# Altium schematic sheet Avalon3.SchDoc
size A0
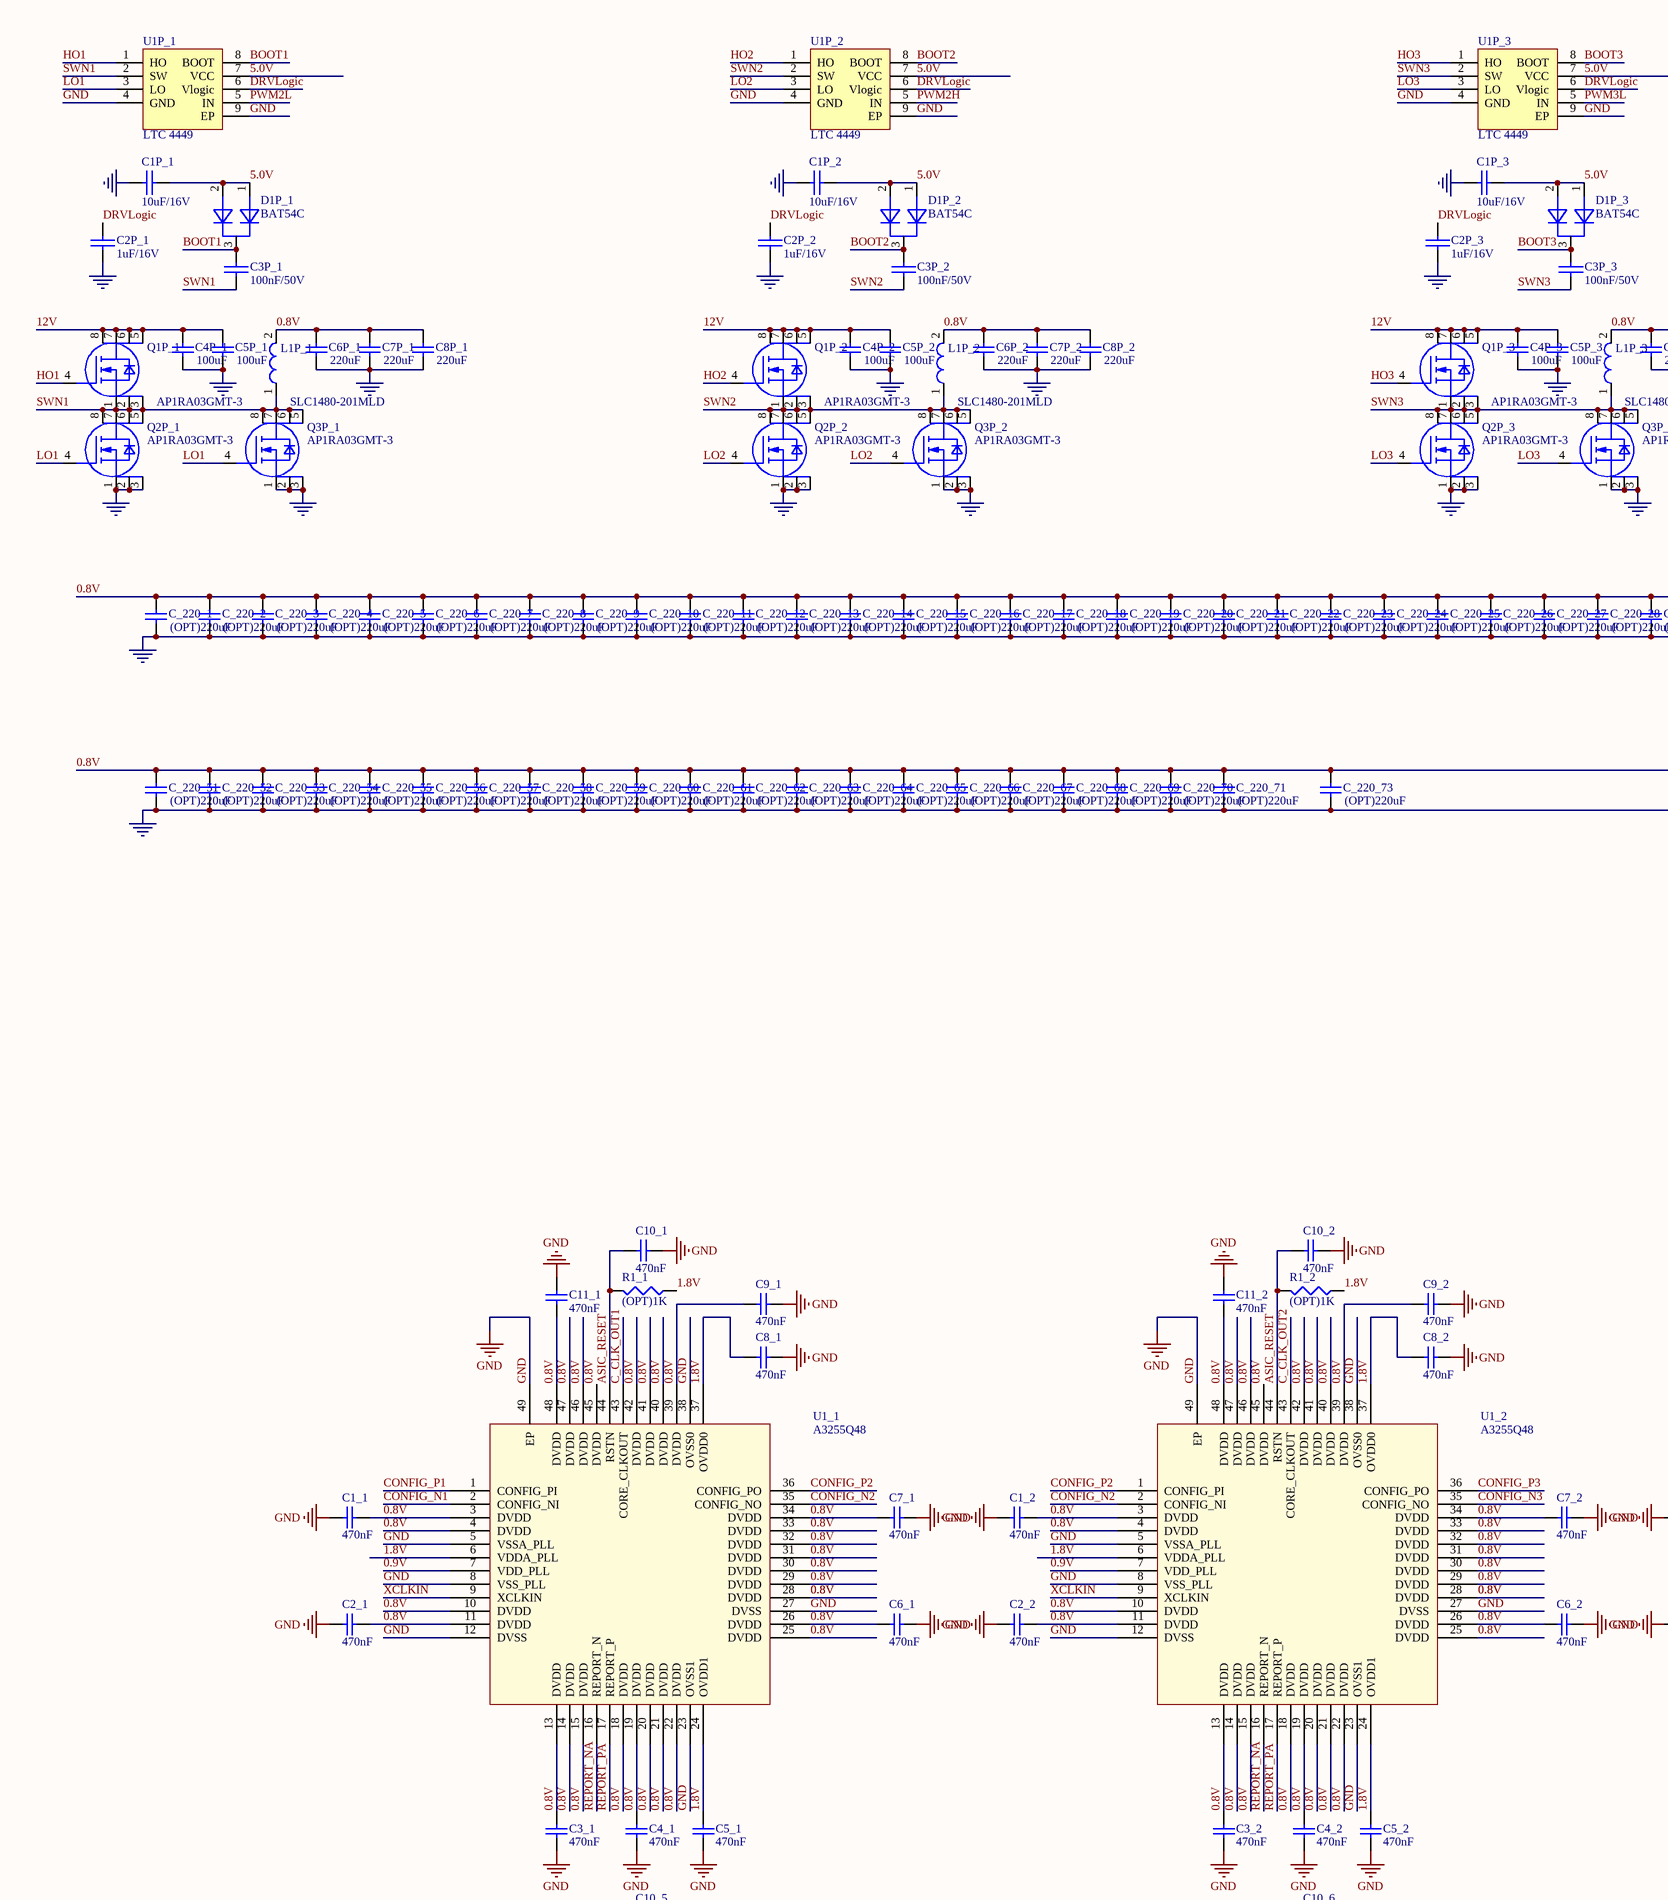
[diagram p0: Avalon3.SchDoc, top left]
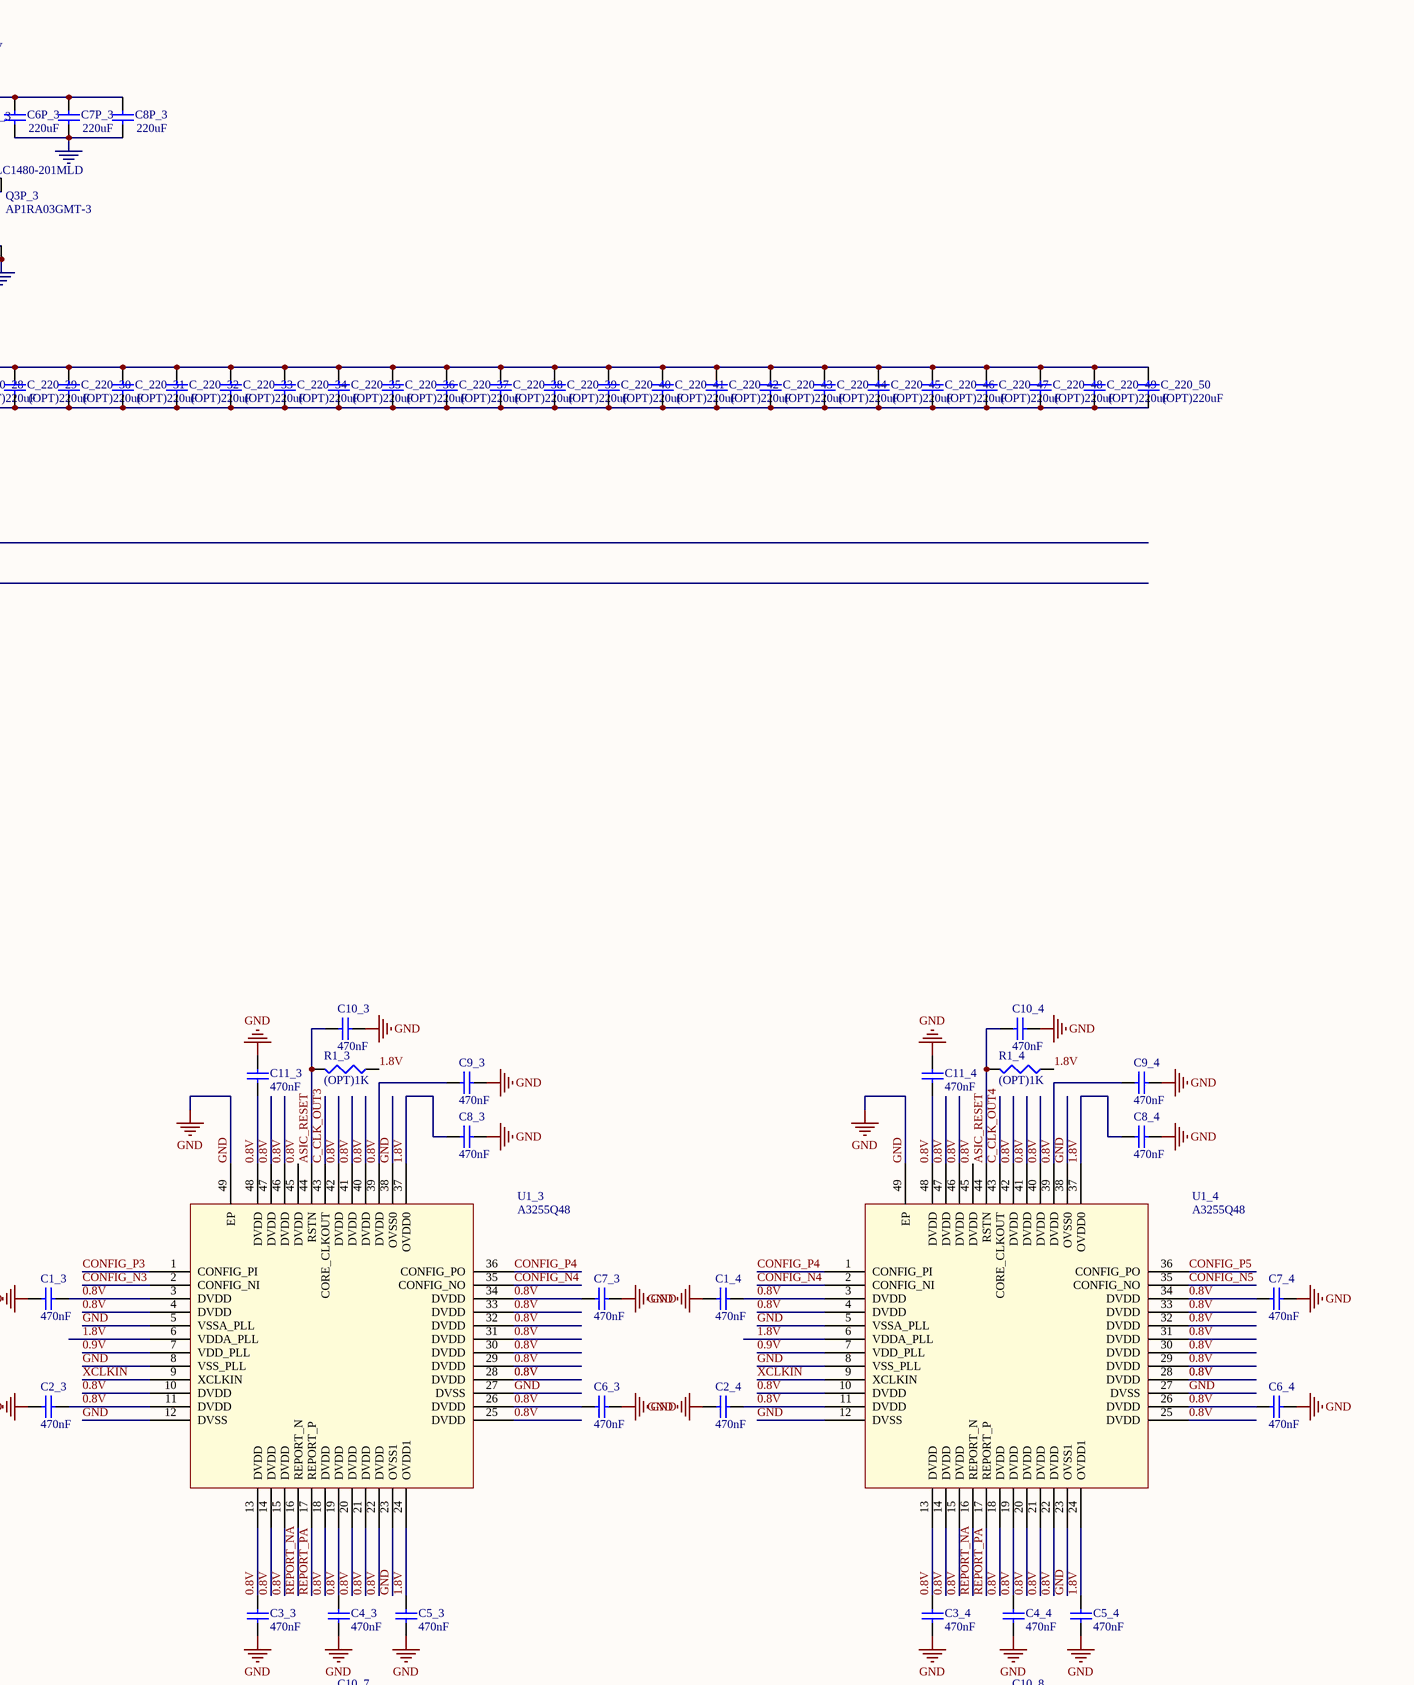
[diagram p1: Avalon3.SchDoc, top middle]
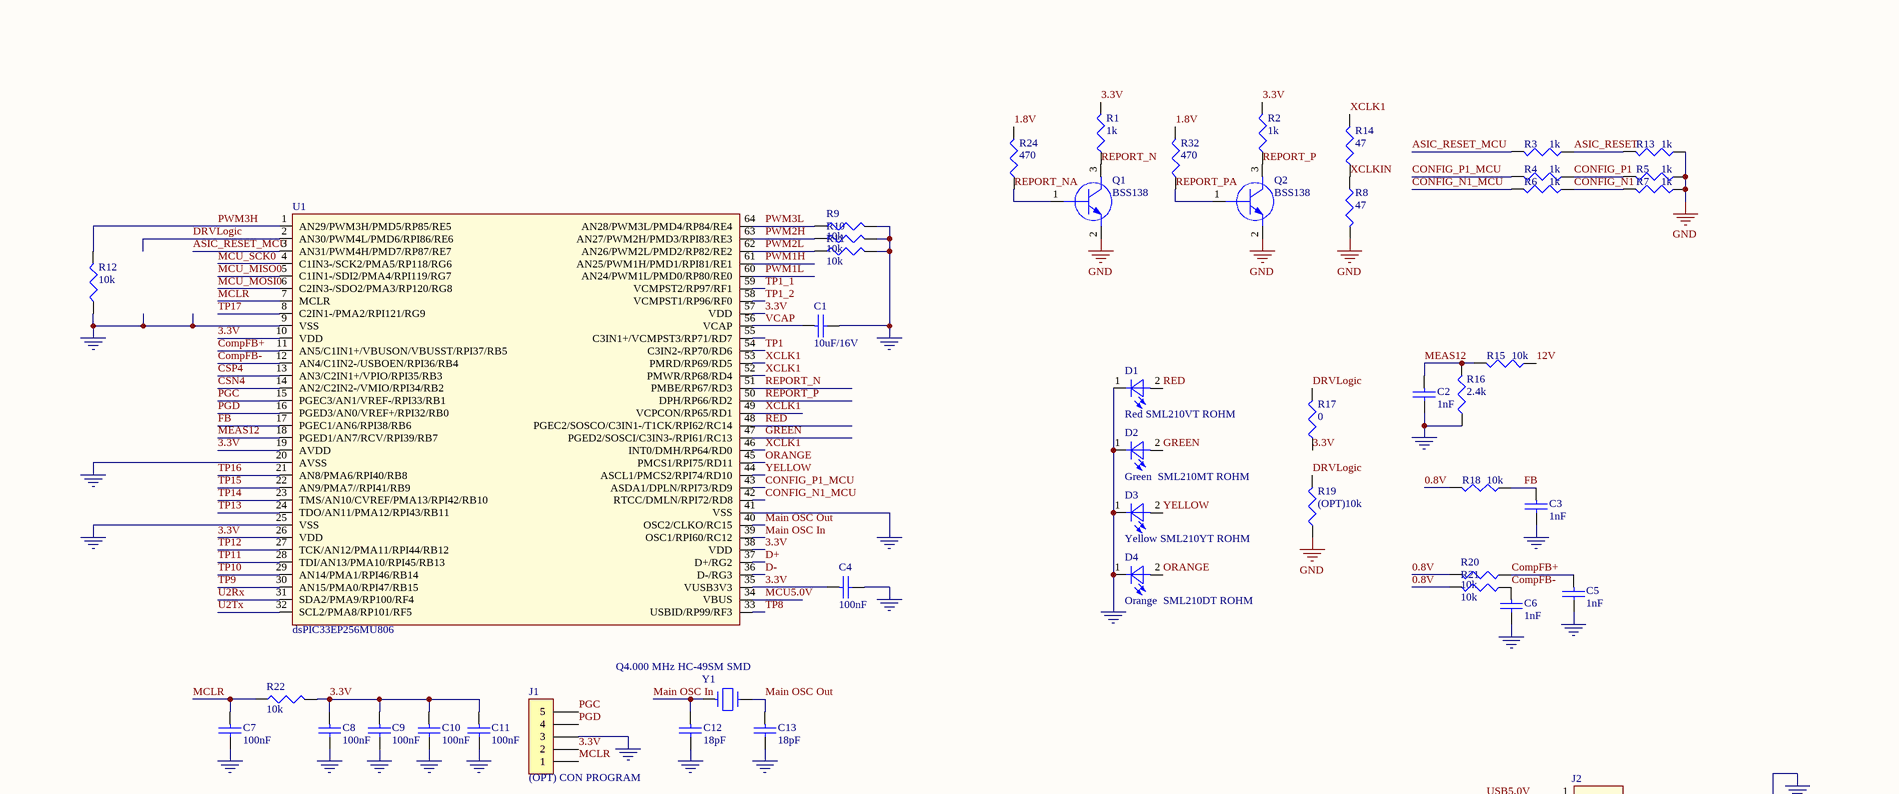
[diagram p2: Avalon3.SchDoc, top right]
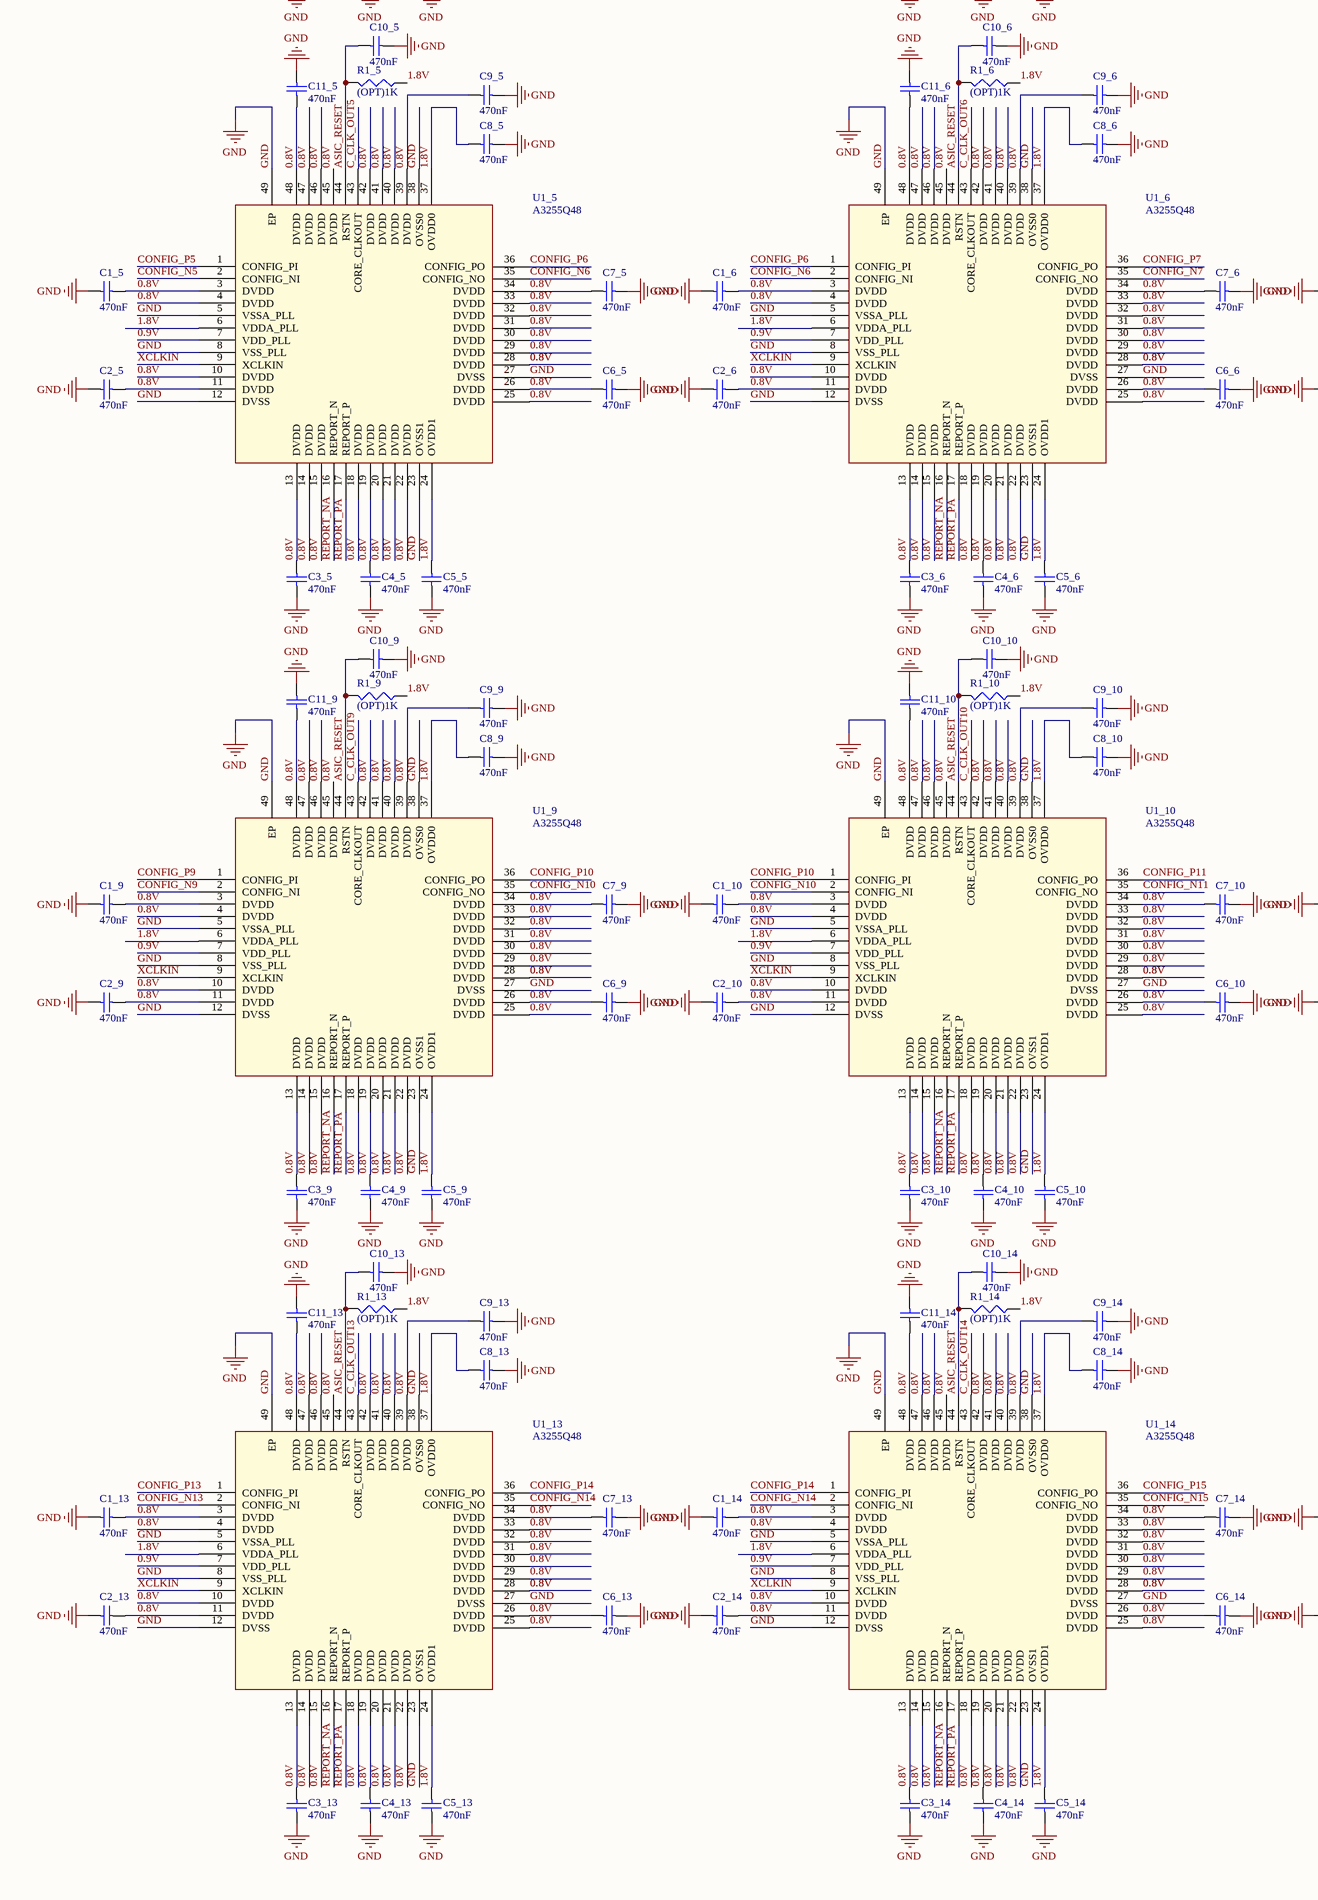
[diagram p3: Avalon3.SchDoc, bottom left]
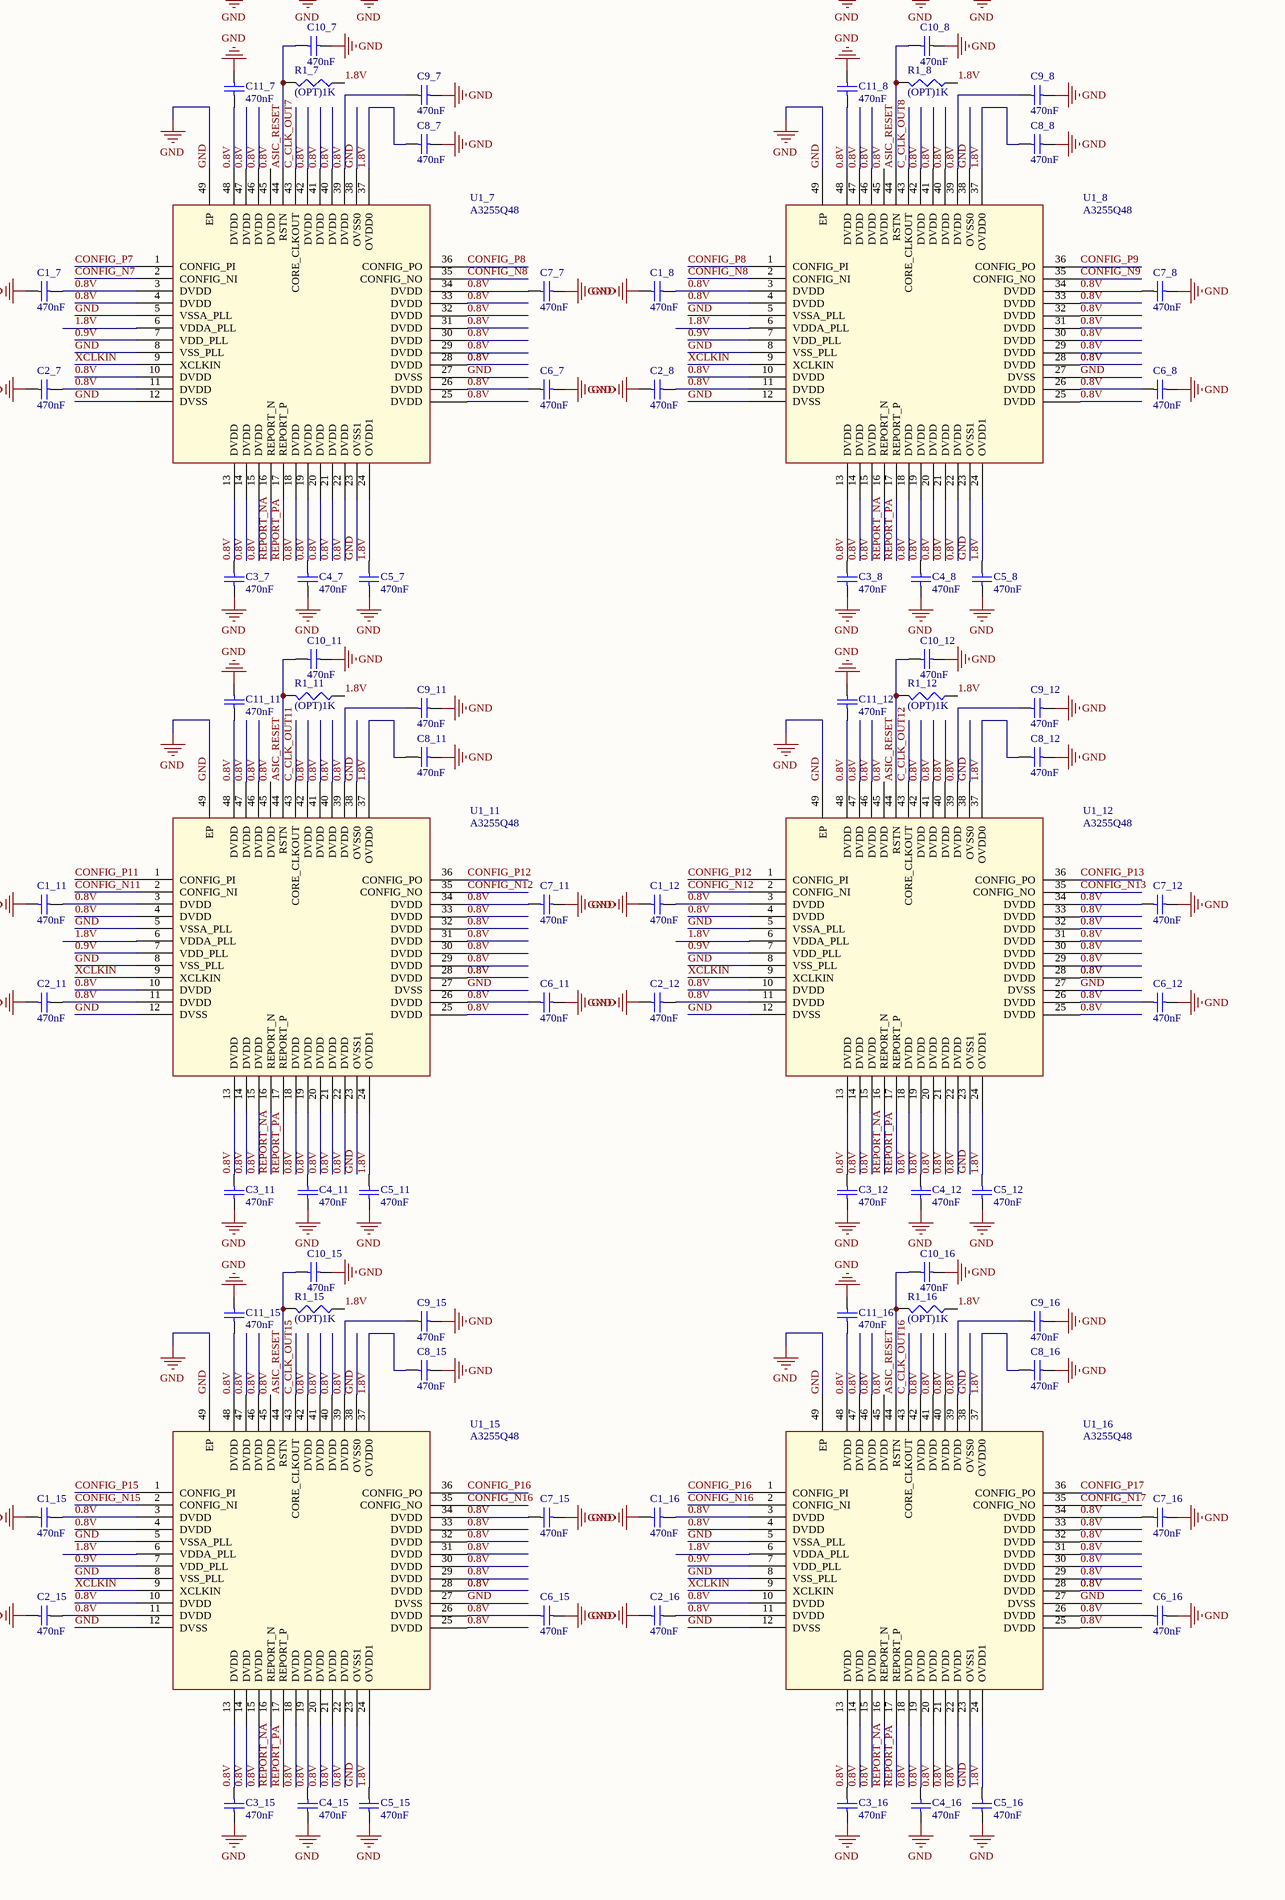
[diagram p4: Avalon3.SchDoc, bottom middle]
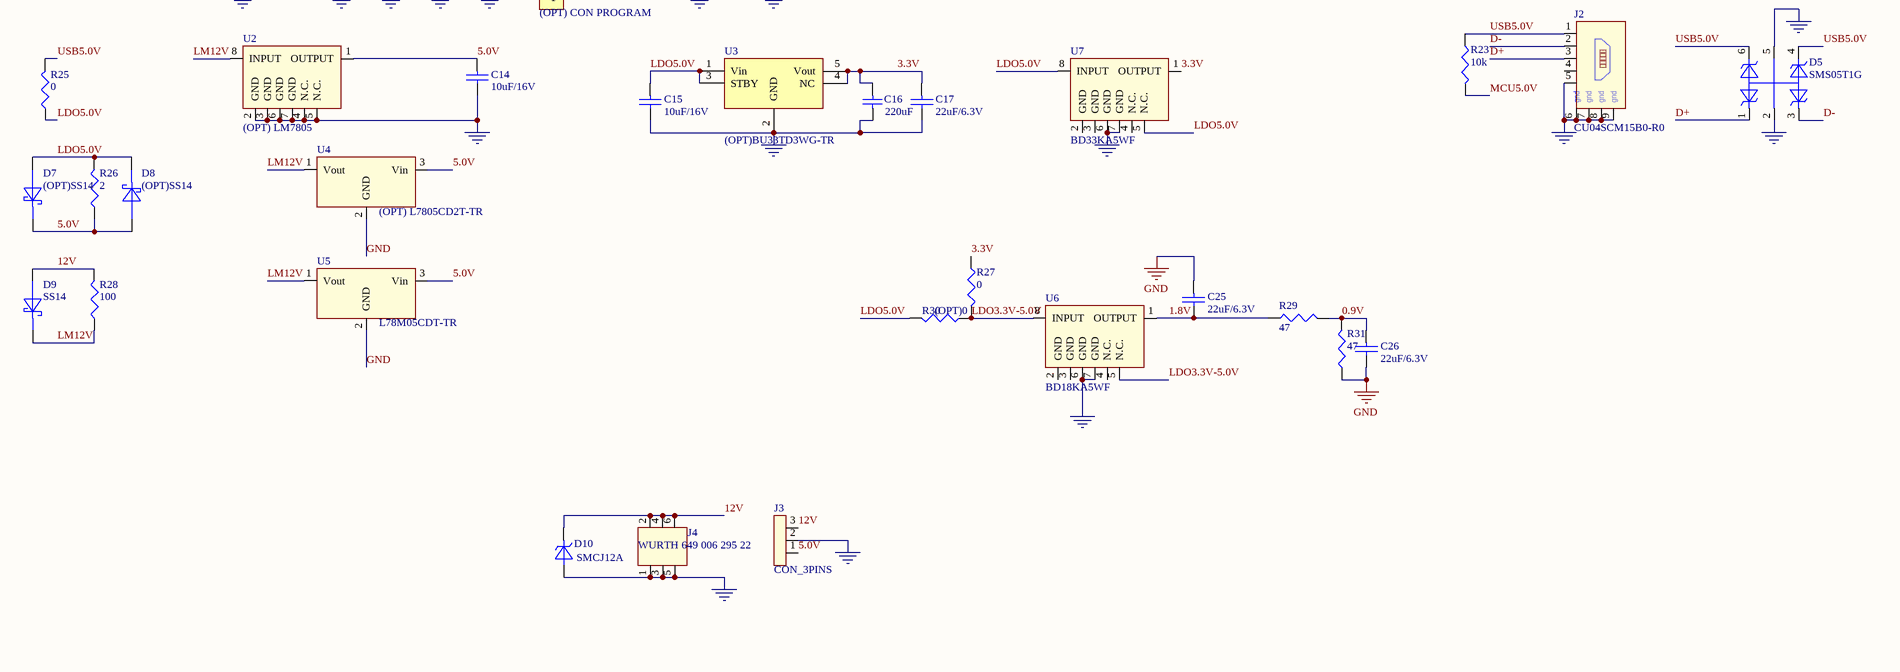
[diagram p5: Avalon3.SchDoc, bottom right]

## Parts
C1  10uF/16V  [SMD_0805_CAPC2012X145N]
C1_1  470nF  [SMD_0603_CAPC1608X80N]
C1_2  470nF  [SMD_0603_CAPC1608X80N]
C1_3  470nF  [SMD_0603_CAPC1608X80N]
C1_4  470nF  [SMD_0603_CAPC1608X80N]
C1_5  470nF  [SMD_0603_CAPC1608X80N]
C1_6  470nF  [SMD_0603_CAPC1608X80N]
C1_7  470nF  [SMD_0603_CAPC1608X80N]
C1_8  470nF  [SMD_0603_CAPC1608X80N]
C1_9  470nF  [SMD_0603_CAPC1608X80N]
C1_10  470nF  [SMD_0603_CAPC1608X80N]
C1_11  470nF  [SMD_0603_CAPC1608X80N]
C1_12  470nF  [SMD_0603_CAPC1608X80N]
C1_13  470nF  [SMD_0603_CAPC1608X80N]
C1_14  470nF  [SMD_0603_CAPC1608X80N]
C1_15  470nF  [SMD_0603_CAPC1608X80N]
C1_16  470nF  [SMD_0603_CAPC1608X80N]
C1P_1  10uF/16V  [SMD_0805_CAPC2012X145N]
C1P_2  10uF/16V  [SMD_0805_CAPC2012X145N]
C1P_3  10uF/16V  [SMD_0805_CAPC2012X145N]
C2  1nF  [SMD_0603_CAPC1608X80N]
C2_1  470nF  [SMD_0603_CAPC1608X80N]
C2_2  470nF  [SMD_0603_CAPC1608X80N]
C2_3  470nF  [SMD_0603_CAPC1608X80N]
C2_4  470nF  [SMD_0603_CAPC1608X80N]
C2_5  470nF  [SMD_0603_CAPC1608X80N]
C2_6  470nF  [SMD_0603_CAPC1608X80N]
C2_7  470nF  [SMD_0603_CAPC1608X80N]
C2_8  470nF  [SMD_0603_CAPC1608X80N]
C2_9  470nF  [SMD_0603_CAPC1608X80N]
C2_10  470nF  [SMD_0603_CAPC1608X80N]
C2_11  470nF  [SMD_0603_CAPC1608X80N]
C2_12  470nF  [SMD_0603_CAPC1608X80N]
C2_13  470nF  [SMD_0603_CAPC1608X80N]
C2_14  470nF  [SMD_0603_CAPC1608X80N]
C2_15  470nF  [SMD_0603_CAPC1608X80N]
C2_16  470nF  [SMD_0603_CAPC1608X80N]
C2P_1  1uF/16V  [SMD_0805_CAPC2012X145N]
C2P_2  1uF/16V  [SMD_0805_CAPC2012X145N]
C2P_3  1uF/16V  [SMD_0805_CAPC2012X145N]
C3  1nF  [SMD_0603_CAPC1608X80N]
C3_1  470nF  [SMD_0603_CAPC1608X80N]
C3_2  470nF  [SMD_0603_CAPC1608X80N]
C3_3  470nF  [SMD_0603_CAPC1608X80N]
C3_4  470nF  [SMD_0603_CAPC1608X80N]
C3_5  470nF  [SMD_0603_CAPC1608X80N]
C3_6  470nF  [SMD_0603_CAPC1608X80N]
C3_7  470nF  [SMD_0603_CAPC1608X80N]
C3_8  470nF  [SMD_0603_CAPC1608X80N]
C3_9  470nF  [SMD_0603_CAPC1608X80N]
C3_10  470nF  [SMD_0603_CAPC1608X80N]
C3_11  470nF  [SMD_0603_CAPC1608X80N]
C3_12  470nF  [SMD_0603_CAPC1608X80N]
C3_13  470nF  [SMD_0603_CAPC1608X80N]
C3_14  470nF  [SMD_0603_CAPC1608X80N]
C3_15  470nF  [SMD_0603_CAPC1608X80N]
C3_16  470nF  [SMD_0603_CAPC1608X80N]
C3P_1  100nF/50V  [SMD_0805_CAPC2012X145N]
C3P_2  100nF/50V  [SMD_0805_CAPC2012X145N]
C3P_3  100nF/50V  [SMD_0805_CAPC2012X145N]
C4  100nF  [SMD_0603_CAPC1608X80N]
C4_1  470nF  [SMD_0603_CAPC1608X80N]
C4_2  470nF  [SMD_0603_CAPC1608X80N]
C4_3  470nF  [SMD_0603_CAPC1608X80N]
C4_4  470nF  [SMD_0603_CAPC1608X80N]
C4_5  470nF  [SMD_0603_CAPC1608X80N]
C4_6  470nF  [SMD_0603_CAPC1608X80N]
C4_7  470nF  [SMD_0603_CAPC1608X80N]
C4_8  470nF  [SMD_0603_CAPC1608X80N]
C4_9  470nF  [SMD_0603_CAPC1608X80N]
C4_10  470nF  [SMD_0603_CAPC1608X80N]
C4_11  470nF  [SMD_0603_CAPC1608X80N]
C4_12  470nF  [SMD_0603_CAPC1608X80N]
C4_13  470nF  [SMD_0603_CAPC1608X80N]
C4_14  470nF  [SMD_0603_CAPC1608X80N]
C4_15  470nF  [SMD_0603_CAPC1608X80N]
C4_16  470nF  [SMD_0603_CAPC1608X80N]
C4P_1  100uF  [SMD_1210_CAPC3225X279N]
C4P_2  100uF  [SMD_1210_CAPC3225X279N]
C4P_3  100uF  [SMD_1210_CAPC3225X279N]
C5  1nF  [SMD_0603_CAPC1608X80N]
C5_1  470nF  [SMD_0603_CAPC1608X80N]
C5_2  470nF  [SMD_0603_CAPC1608X80N]
C5_3  470nF  [SMD_0603_CAPC1608X80N]
C5_4  470nF  [SMD_0603_CAPC1608X80N]
C5_5  470nF  [SMD_0603_CAPC1608X80N]
C5_6  470nF  [SMD_0603_CAPC1608X80N]
C5_7  470nF  [SMD_0603_CAPC1608X80N]
C5_8  470nF  [SMD_0603_CAPC1608X80N]
C5_9  470nF  [SMD_0603_CAPC1608X80N]
C5_10  470nF  [SMD_0603_CAPC1608X80N]
C5_11  470nF  [SMD_0603_CAPC1608X80N]
C5_12  470nF  [SMD_0603_CAPC1608X80N]
C5_13  470nF  [SMD_0603_CAPC1608X80N]
C5_14  470nF  [SMD_0603_CAPC1608X80N]
C5_15  470nF  [SMD_0603_CAPC1608X80N]
C5_16  470nF  [SMD_0603_CAPC1608X80N]
C5P_1  100uF  [SMD_1210_CAPC3225X279N]
C5P_2  100uF  [SMD_1210_CAPC3225X279N]
C5P_3  100uF  [SMD_1210_CAPC3225X279N]
C6  1nF  [SMD_0603_CAPC1608X80N]
C6_1  470nF  [SMD_0603_CAPC1608X80N]
C6_2  470nF  [SMD_0603_CAPC1608X80N]
C6_3  470nF  [SMD_0603_CAPC1608X80N]
C6_4  470nF  [SMD_0603_CAPC1608X80N]
C6_5  470nF  [SMD_0603_CAPC1608X80N]
C6_6  470nF  [SMD_0603_CAPC1608X80N]
C6_7  470nF  [SMD_0603_CAPC1608X80N]
C6_8  470nF  [SMD_0603_CAPC1608X80N]
C6_9  470nF  [SMD_0603_CAPC1608X80N]
C6_10  470nF  [SMD_0603_CAPC1608X80N]
C6_11  470nF  [SMD_0603_CAPC1608X80N]
C6_12  470nF  [SMD_0603_CAPC1608X80N]
C6_13  470nF  [SMD_0603_CAPC1608X80N]
C6_14  470nF  [SMD_0603_CAPC1608X80N]
C6_15  470nF  [SMD_0603_CAPC1608X80N]
C6_16  470nF  [SMD_0603_CAPC1608X80N]
C6P_1  220uF  [SMD_1210_CAPC3225X279N]
C6P_2  220uF  [SMD_1210_CAPC3225X279N]
C6P_3  220uF  [SMD_1210_CAPC3225X279N]
C7  100nF  [SMD_0603_CAPC1608X80N]
C7_1  470nF  [SMD_0603_CAPC1608X80N]
C7_2  470nF  [SMD_0603_CAPC1608X80N]
C7_3  470nF  [SMD_0603_CAPC1608X80N]
C7_4  470nF  [SMD_0603_CAPC1608X80N]
C7_5  470nF  [SMD_0603_CAPC1608X80N]
C7_6  470nF  [SMD_0603_CAPC1608X80N]
C7_7  470nF  [SMD_0603_CAPC1608X80N]
C7_8  470nF  [SMD_0603_CAPC1608X80N]
C7_9  470nF  [SMD_0603_CAPC1608X80N]
C7_10  470nF  [SMD_0603_CAPC1608X80N]
C7_11  470nF  [SMD_0603_CAPC1608X80N]
C7_12  470nF  [SMD_0603_CAPC1608X80N]
C7_13  470nF  [SMD_0603_CAPC1608X80N]
C7_14  470nF  [SMD_0603_CAPC1608X80N]
C7_15  470nF  [SMD_0603_CAPC1608X80N]
C7_16  470nF  [SMD_0603_CAPC1608X80N]
C7P_1  220uF  [SMD_1210_CAPC3225X279N]
C7P_2  220uF  [SMD_1210_CAPC3225X279N]
C7P_3  220uF  [SMD_1210_CAPC3225X279N]
C8  100nF  [SMD_0603_CAPC1608X80N]
C8_1  470nF  [SMD_0603_CAPC1608X80N]
C8_2  470nF  [SMD_0603_CAPC1608X80N]
C8_3  470nF  [SMD_0603_CAPC1608X80N]
C8_4  470nF  [SMD_0603_CAPC1608X80N]
C8_5  470nF  [SMD_0603_CAPC1608X80N]
C8_6  470nF  [SMD_0603_CAPC1608X80N]
C8_7  470nF  [SMD_0603_CAPC1608X80N]
C8_8  470nF  [SMD_0603_CAPC1608X80N]
C8_9  470nF  [SMD_0603_CAPC1608X80N]
C8_10  470nF  [SMD_0603_CAPC1608X80N]
C8_11  470nF  [SMD_0603_CAPC1608X80N]
C8_12  470nF  [SMD_0603_CAPC1608X80N]
C8_13  470nF  [SMD_0603_CAPC1608X80N]
C8_14  470nF  [SMD_0603_CAPC1608X80N]
C8_15  470nF  [SMD_0603_CAPC1608X80N]
C8_16  470nF  [SMD_0603_CAPC1608X80N]
C8P_1  220uF  [SMD_1210_CAPC3225X279N]
C8P_2  220uF  [SMD_1210_CAPC3225X279N]
C8P_3  220uF  [SMD_1210_CAPC3225X279N]
C9  100nF  [SMD_0603_CAPC1608X80N]
C9_1  470nF  [SMD_0603_CAPC1608X80N]
C9_2  470nF  [SMD_0603_CAPC1608X80N]
C9_3  470nF  [SMD_0603_CAPC1608X80N]
C9_4  470nF  [SMD_0603_CAPC1608X80N]
C9_5  470nF  [SMD_0603_CAPC1608X80N]
C9_6  470nF  [SMD_0603_CAPC1608X80N]
C9_7  470nF  [SMD_0603_CAPC1608X80N]
C9_8  470nF  [SMD_0603_CAPC1608X80N]
C9_9  470nF  [SMD_0603_CAPC1608X80N]
C9_10  470nF  [SMD_0603_CAPC1608X80N]
C9_11  470nF  [SMD_0603_CAPC1608X80N]
C9_12  470nF  [SMD_0603_CAPC1608X80N]
C9_13  470nF  [SMD_0603_CAPC1608X80N]
C9_14  470nF  [SMD_0603_CAPC1608X80N]
C9_15  470nF  [SMD_0603_CAPC1608X80N]
C9_16  470nF  [SMD_0603_CAPC1608X80N]
C10  100nF  [SMD_0603_CAPC1608X80N]
C10_1  470nF  [SMD_0603_CAPC1608X80N]
C10_2  470nF  [SMD_0603_CAPC1608X80N]
C10_3  470nF  [SMD_0603_CAPC1608X80N]
C10_4  470nF  [SMD_0603_CAPC1608X80N]
C10_5  470nF  [SMD_0603_CAPC1608X80N]
C10_6  470nF  [SMD_0603_CAPC1608X80N]
C10_7  470nF  [SMD_0603_CAPC1608X80N]
C10_8  470nF  [SMD_0603_CAPC1608X80N]
C10_9  470nF  [SMD_0603_CAPC1608X80N]
C10_10  470nF  [SMD_0603_CAPC1608X80N]
C10_11  470nF  [SMD_0603_CAPC1608X80N]
C10_12  470nF  [SMD_0603_CAPC1608X80N]
C10_13  470nF  [SMD_0603_CAPC1608X80N]
C10_14  470nF  [SMD_0603_CAPC1608X80N]
C10_15  470nF  [SMD_0603_CAPC1608X80N]
C10_16  470nF  [SMD_0603_CAPC1608X80N]
C11  100nF  [SMD_0603_CAPC1608X80N]
C11_1  470nF  [SMD_0603_CAPC1608X80N]
C11_2  470nF  [SMD_0603_CAPC1608X80N]
C11_3  470nF  [SMD_0603_CAPC1608X80N]
C11_4  470nF  [SMD_0603_CAPC1608X80N]
C11_5  470nF  [SMD_0603_CAPC1608X80N]
C11_6  470nF  [SMD_0603_CAPC1608X80N]
C11_7  470nF  [SMD_0603_CAPC1608X80N]
C11_8  470nF  [SMD_0603_CAPC1608X80N]
C11_9  470nF  [SMD_0603_CAPC1608X80N]
C11_10  470nF  [SMD_0603_CAPC1608X80N]
C11_11  470nF  [SMD_0603_CAPC1608X80N]
C11_12  470nF  [SMD_0603_CAPC1608X80N]
C11_13  470nF  [SMD_0603_CAPC1608X80N]
C11_14  470nF  [SMD_0603_CAPC1608X80N]
C11_15  470nF  [SMD_0603_CAPC1608X80N]
C11_16  470nF  [SMD_0603_CAPC1608X80N]
C12  18pF  [SMD_0603_CAPC1608X80N]
C13  18pF  [SMD_0603_CAPC1608X80N]
C14  10uF/16V  [SMD_0805_CAPC2012X145N]
C15  10uF/16V  [SMD_0805_CAPC2012X145N]
C16  220uF  [SMD_1210_CAPC3225X279N]
C17  22uF/6.3V  [SMD_0805_CAPC2012X145N]
C25  22uF/6.3V  [SMD_0805_CAPC2012X145N]
C26  22uF/6.3V  [SMD_0805_CAPC2012X145N]
C_220_1  (OPT)220uF  [SMD_1210_CAPC3225X279N]
C_220_2  (OPT)220uF  [SMD_1210_CAPC3225X279N]
C_220_3  (OPT)220uF  [SMD_1210_CAPC3225X279N]
C_220_4  (OPT)220uF  [SMD_1210_CAPC3225X279N]
C_220_5  (OPT)220uF  [SMD_1210_CAPC3225X279N]
C_220_6  (OPT)220uF  [SMD_1210_CAPC3225X279N]
C_220_7  (OPT)220uF  [SMD_1210_CAPC3225X279N]
C_220_8  (OPT)220uF  [SMD_1210_CAPC3225X279N]
C_220_9  (OPT)220uF  [SMD_1210_CAPC3225X279N]
C_220_10  (OPT)220uF  [SMD_1210_CAPC3225X279N]
C_220_11  (OPT)220uF  [SMD_1210_CAPC3225X279N]
C_220_12  (OPT)220uF  [SMD_1210_CAPC3225X279N]
C_220_13  (OPT)220uF  [SMD_1210_CAPC3225X279N]
C_220_14  (OPT)220uF  [SMD_1210_CAPC3225X279N]
C_220_15  (OPT)220uF  [SMD_1210_CAPC3225X279N]
C_220_16  (OPT)220uF  [SMD_1210_CAPC3225X279N]
C_220_17  (OPT)220uF  [SMD_1210_CAPC3225X279N]
C_220_18  (OPT)220uF  [SMD_1210_CAPC3225X279N]
C_220_19  (OPT)220uF  [SMD_1210_CAPC3225X279N]
C_220_20  (OPT)220uF  [SMD_1210_CAPC3225X279N]
C_220_21  (OPT)220uF  [SMD_1210_CAPC3225X279N]
C_220_22  (OPT)220uF  [SMD_1210_CAPC3225X279N]
C_220_23  (OPT)220uF  [SMD_1210_CAPC3225X279N]
C_220_24  (OPT)220uF  [SMD_1210_CAPC3225X279N]
C_220_25  (OPT)220uF  [SMD_1210_CAPC3225X279N]
C_220_26  (OPT)220uF  [SMD_1210_CAPC3225X279N]
C_220_27  (OPT)220uF  [SMD_1210_CAPC3225X279N]
C_220_28  (OPT)220uF  [SMD_1210_CAPC3225X279N]
C_220_29  (OPT)220uF  [SMD_1210_CAPC3225X279N]
C_220_30  (OPT)220uF  [SMD_1210_CAPC3225X279N]
C_220_31  (OPT)220uF  [SMD_1210_CAPC3225X279N]
C_220_32  (OPT)220uF  [SMD_1210_CAPC3225X279N]
C_220_33  (OPT)220uF  [SMD_1210_CAPC3225X279N]
C_220_34  (OPT)220uF  [SMD_1210_CAPC3225X279N]
C_220_35  (OPT)220uF  [SMD_1210_CAPC3225X279N]
C_220_36  (OPT)220uF  [SMD_1210_CAPC3225X279N]
C_220_37  (OPT)220uF  [SMD_1210_CAPC3225X279N]
C_220_38  (OPT)220uF  [SMD_1210_CAPC3225X279N]
C_220_39  (OPT)220uF  [SMD_1210_CAPC3225X279N]
C_220_40  (OPT)220uF  [SMD_1210_CAPC3225X279N]
C_220_41  (OPT)220uF  [SMD_1210_CAPC3225X279N]
C_220_42  (OPT)220uF  [SMD_1210_CAPC3225X279N]
C_220_43  (OPT)220uF  [SMD_1210_CAPC3225X279N]
C_220_44  (OPT)220uF  [SMD_1210_CAPC3225X279N]
C_220_45  (OPT)220uF  [SMD_1210_CAPC3225X279N]
C_220_46  (OPT)220uF  [SMD_1210_CAPC3225X279N]
C_220_47  (OPT)220uF  [SMD_1210_CAPC3225X279N]
C_220_48  (OPT)220uF  [SMD_1210_CAPC3225X279N]
C_220_49  (OPT)220uF  [SMD_1210_CAPC3225X279N]
C_220_50  (OPT)220uF  [SMD_1210_CAPC3225X279N]
C_220_51  (OPT)220uF  [SMD_1210_CAPC3225X279N]
C_220_52  (OPT)220uF  [SMD_1210_CAPC3225X279N]
C_220_53  (OPT)220uF  [SMD_1210_CAPC3225X279N]
C_220_54  (OPT)220uF  [SMD_1210_CAPC3225X279N]
C_220_55  (OPT)220uF  [SMD_1210_CAPC3225X279N]
C_220_56  (OPT)220uF  [SMD_1210_CAPC3225X279N]
C_220_57  (OPT)220uF  [SMD_1210_CAPC3225X279N]
C_220_58  (OPT)220uF  [SMD_1210_CAPC3225X279N]
C_220_59  (OPT)220uF  [SMD_1210_CAPC3225X279N]
C_220_60  (OPT)220uF  [SMD_1210_CAPC3225X279N]
C_220_61  (OPT)220uF  [SMD_1210_CAPC3225X279N]
C_220_62  (OPT)220uF  [SMD_1210_CAPC3225X279N]
C_220_63  (OPT)220uF  [SMD_1210_CAPC3225X279N]
C_220_64  (OPT)220uF  [SMD_1210_CAPC3225X279N]
C_220_65  (OPT)220uF  [SMD_1210_CAPC3225X279N]
C_220_66  (OPT)220uF  [SMD_1210_CAPC3225X279N]
C_220_67  (OPT)220uF  [SMD_1210_CAPC3225X279N]
C_220_68  (OPT)220uF  [SMD_1210_CAPC3225X279N]
C_220_69  (OPT)220uF  [SMD_1210_CAPC3225X279N]
C_220_70  (OPT)220uF  [SMD_1210_CAPC3225X279N]
C_220_71  (OPT)220uF  [SMD_1210_CAPC3225X279N]
C_220_73  (OPT)220uF  [SMD_1210_CAPC3225X279N]
D1  Red SML210VT ROHM  [SMD_0805_LED2012X100N]
D1P_1  BAT54C  [SMD_SOT23_SOT95P240X120-3N]
D1P_2  BAT54C  [SMD_SOT23_SOT95P240X120-3N]
D1P_3  BAT54C  [SMD_SOT23_SOT95P240X120-3N]
D2  Green 	SML210MT ROHM  [SMD_0805_LED2012X100N]
D3  Yellow SML210YT ROHM  [SMD_0805_LED2012X100N]
D4  Orange 	SML210DT ROHM  [SMD_0805_LED2012X100N]
D5  SMS05T1G  [SMD_SOT95P280X145-6N-W]
D7  (OPT)SS14  [SMD_DO214AC_SMA]
D8  (OPT)SS14  [SMD_DO214AC_SMA]
D9  SS14  [SMD_DO214AC_SMA]
D10  SMCJ12A  [SMD_DO214AC_SMC]
J1  (OPT) CON PROGRAM  [SIP5 PGM TOP]
J2  CU04SCM15B0-R0  [SMD_CON-CVILUX-CU04-SCM15B0]
J3  CON_3PINS  [PTH_CON_3.5mm_3PINs]
J4  WURTH 649 006 295 22  [PTH_CON_PCI-E]
L1P_1  SLC1480-201MLD  [SMD_INDM12501250X800A - Coilcraft SLC1480]
L1P_2  SLC1480-201MLD  [SMD_INDM12501250X800A - Coilcraft SLC1480]
L1P_3  SLC1480-201MLD  [SMD_INDM12501250X800A - Coilcraft SLC1480]
Q1  BSS138  [SMD_SOT23_SOT95P240X120-3N]
Q1P_1  AP1RA03GMT-3  [SMD_SON127P615X520X100-8N]
Q1P_2  AP1RA03GMT-3  [SMD_SON127P615X520X100-8N]
Q1P_3  AP1RA03GMT-3  [SMD_SON127P615X520X100-8N]
Q2  BSS138  [SMD_SOT23_SOT95P240X120-3N]
Q2P_1  AP1RA03GMT-3  [SMD_SON127P615X520X100-8N]
Q2P_2  AP1RA03GMT-3  [SMD_SON127P615X520X100-8N]
Q2P_3  AP1RA03GMT-3  [SMD_SON127P615X520X100-8N]
Q3P_1  AP1RA03GMT-3  [SMD_SON127P615X520X100-8N]
Q3P_2  AP1RA03GMT-3  [SMD_SON127P615X520X100-8N]
Q3P_3  AP1RA03GMT-3  [SMD_SON127P615X520X100-8N]
R1  1k  [SMD_0603_RESC1608X55N]
R1_1  (OPT)1K  [SMD_0603_RESC1608X55N]
R1_2  (OPT)1K  [SMD_0603_RESC1608X55N]
R1_3  (OPT)1K  [SMD_0603_RESC1608X55N]
R1_4  (OPT)1K  [SMD_0603_RESC1608X55N]
R1_5  (OPT)1K  [SMD_0603_RESC1608X55N]
R1_6  (OPT)1K  [SMD_0603_RESC1608X55N]
R1_7  (OPT)1K  [SMD_0603_RESC1608X55N]
R1_8  (OPT)1K  [SMD_0603_RESC1608X55N]
R1_9  (OPT)1K  [SMD_0603_RESC1608X55N]
R1_10  (OPT)1K  [SMD_0603_RESC1608X55N]
R1_11  (OPT)1K  [SMD_0603_RESC1608X55N]
R1_12  (OPT)1K  [SMD_0603_RESC1608X55N]
R1_13  (OPT)1K  [SMD_0603_RESC1608X55N]
R1_14  (OPT)1K  [SMD_0603_RESC1608X55N]
R1_15  (OPT)1K  [SMD_0603_RESC1608X55N]
R1_16  (OPT)1K  [SMD_0603_RESC1608X55N]
R2  1k  [SMD_0603_RESC1608X55N]
R3  1k  [SMD_0603_RESC1608X55N]
R4  1k  [SMD_0603_RESC1608X55N]
R5  1k  [SMD_0603_RESC1608X55N]
R6  1k  [SMD_0603_RESC1608X55N]
R7  1k  [SMD_0603_RESC1608X55N]
R8  47  [SMD_0603_RESC1608X55N]
R9  10k  [SMD_0603_RESC1608X55N]
R10  10k  [SMD_0603_RESC1608X55N]
R11  10k  [SMD_0603_RESC1608X55N]
R12  10k  [SMD_0603_RESC1608X55N]
R13  1k  [SMD_0603_RESC1608X55N]
R14  47  [SMD_0603_RESC1608X55N]
R15  10k  [SMD_0603_RESC1608X55N]
R16  2.4k  [SMD_0603_RESC1608X55N]
R17  0  [SMD_0603_RESC1608X55N]
R18  10k  [SMD_0603_RESC1608X55N]
R19  (OPT)10k  [SMD_0603_RESC1608X55N]
R20  10k  [SMD_0603_RESC1608X55N]
R21  10k  [SMD_0603_RESC1608X55N]
R22  10k  [SMD_0603_RESC1608X55N]
R23  10k  [SMD_0603_RESC1608X55N]
R24  470  [SMD_0603_RESC1608X55N]
R25  0  [SMD_0603_RESC1608X55N]
R26  2  [SMD_1206_RESC3216X180N]
R27  0  [SMD_0603_RESC1608X55N]
R28  100  [SMD_1206_RESC3216X180N]
R29  47  [SMD_0603_RESC1608X55N]
R30  (OPT)0  [SMD_0603_RESC1608X55N]
R31  47  [SMD_0603_RESC1608X55N]
R32  470  [SMD_0603_RESC1608X55N]
U1  dsPIC33EP256MU806  [SMD_QFP50P1200X1200X120-64N]
U1_1  A3255Q48  [SMD_QFN50P700X700X90-49N]
U1_2  A3255Q48  [SMD_QFN50P700X700X90-49N]
U1_3  A3255Q48  [SMD_QFN50P700X700X90-49N]
U1_4  A3255Q48  [SMD_QFN50P700X700X90-49N]
U1_5  A3255Q48  [SMD_QFN50P700X700X90-49N]
U1_6  A3255Q48  [SMD_QFN50P700X700X90-49N]
U1_7  A3255Q48  [SMD_QFN50P700X700X90-49N]
U1_8  A3255Q48  [SMD_QFN50P700X700X90-49N]
U1_9  A3255Q48  [SMD_QFN50P700X700X90-49N]
U1_10  A3255Q48  [SMD_QFN50P700X700X90-49N]
U1_11  A3255Q48  [SMD_QFN50P700X700X90-49N]
U1_12  A3255Q48  [SMD_QFN50P700X700X90-49N]
U1_13  A3255Q48  [SMD_QFN50P700X700X90-49N]
U1_14  A3255Q48  [SMD_QFN50P700X700X90-49N]
U1_15  A3255Q48  [SMD_QFN50P700X700X90-49N]
U1_16  A3255Q48  [SMD_QFN50P700X700X90-49N]
U1P_1  LTC 4449  [SMD_DFN16166SON50P161X161X60-9N - LTC4449]
U1P_2  LTC 4449  [SMD_DFN16166SON50P161X161X60-9N - LTC4449]
U1P_3  LTC 4449  [SMD_DFN16166SON50P161X161X60-9N - LTC4449]
U2  (OPT) LM7805  [SMD_SOIC127P602X173-8N]
U3  (OPT)BU33TD3WG-TR  [SMD_SOT26_SOT95P285X140-5N - DLV]
U4  (OPT) L7805CD2T-TR  [SMD_TO254P1524X483-3_4N_D2PAK]
U5  L78M05CDT-TR  [SMD_TO229P991X239-4AN_DPAK]
U6  BD18KA5WF  [SMD_SOIC127P602X173-8N]
U7  BD33KA5WF  [SMD_SOIC127P602X173-8N]
Y1  Q4.000 MHz HC-49SM SMD  [SMD_HC49_XTAL1140X480X420N]

## Nets
GND: C1.2 C1_1.2 C1_2.2 C1_3.2 C1_4.2 C1_5.2 C1_6.2 C1_7.2 C1_8.2 C1_9.2 C1_10.2 C1_11.2 C1_12.2 C1_13.2 C1_14.2 C1_15.2 C1_16.2 C1P_1.1 C1P_2.1 C1P_3.1 C2.2 C2_1.2 C2_2.2 C2_3.2 C2_4.2 C2_5.2 C2_6.2 C2_7.2 C2_8.2 C2_9.2 C2_10.2 C2_11.2 C2_12.2 C2_13.2 C2_14.2 C2_15.2 C2_16.2 C2P_1.2 C2P_2.2 C2P_3.2 C3.2 C3_1.2 C3_2.2 C3_3.2 C3_4.2 C3_5.2 C3_6.2 C3_7.2 C3_8.2 C3_9.2 C3_10.2 C3_11.2 C3_12.2 C3_13.2 C3_14.2 C3_15.2 C3_16.2 C4.2 C4_1.2 C4_2.2 C4_3.2 C4_4.2 C4_5.2 C4_6.2 C4_7.2 C4_8.2 C4_9.2 C4_10.2 C4_11.2 C4_12.2 C4_13.2 C4_14.2 C4_15.2 C4_16.2 C4P_1.2 C4P_2.2 C4P_3.2 C5.2 C5_1.1 C5_2.1 C5_3.1 C5_4.1 C5_5.1 C5_6.1 C5_7.1 C5_8.1 C5_9.1 C5_10.1 C5_11.1 C5_12.1 C5_13.1 C5_14.1 C5_15.1 C5_16.1 C5P_1.2 C5P_2.2 C5P_3.2 C6.2 C6_1.2 C6_2.2 C6_3.2 C6_4.2 C6_5.2 C6_6.2 C6_7.2 C6_8.2 C6_9.2 C6_10.2 C6_11.2 C6_12.2 C6_13.2 C6_14.2 C6_15.2 C6_16.2 C6P_1.2 C6P_2.2 C6P_3.2 C7.2 C7_1.2 C7_2.2 C7_3.2 C7_4.2 C7_5.2 C7_6.2 C7_7.2 C7_8.2 C7_9.2 C7_10.2 C7_11.2 C7_12.2 C7_13.2 C7_14.2 C7_15.2 C7_16.2 C7P_1.2 C7P_2.2 C7P_3.2 C8.2 C8_1.2 C8_2.2 C8_3.2 C8_4.2 C8_5.2 C8_6.2 C8_7.2 C8_8.2 C8_9.2 C8_10.2 C8_11.2 C8_12.2 C8_13.2 C8_14.2 C8_15.2 C8_16.2 C8P_1.2 C8P_2.2 C8P_3.2 C9.2 C9_1.2 C9_2.2 C9_3.2 C9_4.2 C9_5.2 C9_6.2 C9_7.2 C9_8.2 C9_9.2 C9_10.2 C9_11.2 C9_12.2 C9_13.2 C9_14.2 C9_15.2 C9_16.2 C10.2 C10_1.2 C10_2.2 C10_3.2 C10_4.2 C10_5.2 C10_6.2 C10_7.2 C10_8.2 C10_9.2 C10_10.2 C10_11.2 C10_12.2 C10_13.2 C10_14.2 C10_15.2 C10_16.2 C11.2 C11_1.2 C11_2.2 C11_3.2 C11_4.2 C11_5.2 C11_6.2 C11_7.2 C11_8.2 C11_9.2 C11_10.2 C11_11.2 C11_12.2 C11_13.2 C11_14.2 C11_15.2 C11_16.2 C12.2 C13.2 C14.2 C15.2 C16.2 C17.2 C25.1 C26.2 C_220_1.2 C_220_2.2 C_220_3.2 C_220_4.2 C_220_5.2 C_220_6.2 C_220_7.2 C_220_8.2 C_220_9.2 C_220_10.2 C_220_11.2 C_220_12.2 C_220_13.2 C_220_14.2 C_220_15.2 C_220_16.2 C_220_17.2 C_220_18.2 C_220_19.2 C_220_20.2 C_220_21.2 C_220_22.2 C_220_23.2 C_220_24.2 C_220_25.2 C_220_26.2 C_220_27.2 C_220_28.2 C_220_29.2 C_220_30.2 C_220_31.2 C_220_32.2 C_220_33.2 C_220_34.2 C_220_35.2 C_220_36.2 C_220_37.2 C_220_38.2 C_220_39.2 C_220_40.2 C_220_41.2 C_220_42.2 C_220_43.2 C_220_44.2 C_220_45.2 C_220_46.2 C_220_47.2 C_220_48.2 C_220_49.2 C_220_50.2 C_220_51.2 C_220_52.2 C_220_53.2 C_220_54.2 C_220_55.2 C_220_56.2 C_220_57.2 C_220_58.2 C_220_59.2 C_220_60.2 C_220_61.2 C_220_62.2 C_220_63.2 C_220_64.2 C_220_65.2 C_220_66.2 C_220_67.2 C_220_68.2 C_220_69.2 C_220_70.2 C_220_71.2 C_220_73.2 D1.1(C) D2.1(C) D3.1(C) D4.1(C) D5.2(AAAA) D5.5(C4) D10.2(A) J1.3 J2.5 J2.6 J2.7 J2.8 J2.9 J3.2 J4.1 J4.3 J4.5 Q1.2(E) Q2.2(E) Q2P_1.1(S) Q2P_1.2(S) Q2P_1.3(S) Q2P_2.1(S) Q2P_2.2(S) Q2P_2.3(S) Q2P_3.1(S) Q2P_3.2(S) Q2P_3.3(S) Q3P_1.1(S) Q3P_1.2(S) Q3P_1.3(S) Q3P_2.1(S) Q3P_2.2(S) Q3P_2.3(S) Q3P_3.1(S) Q3P_3.2(S) Q3P_3.3(S) R5.1 R7.1 R8.2 R9.2 R10.2 R11.2 R12.1 R13.1 R16.1 R19.1 R31.1 U1.9(VSS) U1.20(AVSS) U1.25(VSS) U1.41(VSS) U1_1.5(VSSA_PLL) U1_1.8(VSS_PLL) U1_1.12(DVSS) U1_1.23(OVSS1) U1_1.27(DVSS) U1_1.38(OVSS0) U1_1.49(EP) U1_2.5(VSSA_PLL) U1_2.8(VSS_PLL) U1_2.12(DVSS) U1_2.23(OVSS1) U1_2.27(DVSS) U1_2.38(OVSS0) U1_2.49(EP) U1_3.5(VSSA_PLL) U1_3.8(VSS_PLL) U1_3.12(DVSS) U1_3.23(OVSS1) U1_3.27(DVSS) U1_3.38(OVSS0) U1_3.49(EP) U1_4.5(VSSA_PLL) U1_4.8(VSS_PLL) U1_4.12(DVSS) U1_4.23(OVSS1) U1_4.27(DVSS) U1_4.38(OVSS0) U1_4.49(EP) U1_5.5(VSSA_PLL) U1_5.8(VSS_PLL) U1_5.12(DVSS) U1_5.23(OVSS1) U1_5.27(DVSS) U1_5.38(OVSS0) U1_5.49(EP) U1_6.5(VSSA_PLL) U1_6.8(VSS_PLL) U1_6.12(DVSS) U1_6.23(OVSS1) U1_6.27(DVSS) U1_6.38(OVSS0) U1_6.49(EP) U1_7.5(VSSA_PLL) U1_7.8(VSS_PLL) U1_7.12(DVSS) U1_7.23(OVSS1) U1_7.27(DVSS) U1_7.38(OVSS0) U1_7.49(EP) U1_8.5(VSSA_PLL) U1_8.8(VSS_PLL) U1_8.12(DVSS) U1_8.23(OVSS1) U1_8.27(DVSS) U1_8.38(OVSS0) U1_8.49(EP) U1_9.5(VSSA_PLL) U1_9.8(VSS_PLL) U1_9.12(DVSS) U1_9.23(OVSS1) U1_9.27(DVSS) U1_9.38(OVSS0) U1_9.49(EP) U1_10.5(VSSA_PLL) U1_10.8(VSS_PLL) U1_10.12(DVSS) U1_10.23(OVSS1) U1_10.27(DVSS) U1_10.38(OVSS0) U1_10.49(EP) U1_11.5(VSSA_PLL) U1_11.8(VSS_PLL) U1_11.12(DVSS) U1_11.23(OVSS1) U1_11.27(DVSS) U1_11.38(OVSS0) U1_11.49(EP) U1_12.5(VSSA_PLL) U1_12.8(VSS_PLL) U1_12.12(DVSS) U1_12.23(OVSS1) U1_12.27(DVSS) U1_12.38(OVSS0) U1_12.49(EP) U1_13.5(VSSA_PLL) U1_13.8(VSS_PLL) U1_13.12(DVSS) U1_13.23(OVSS1) U1_13.27(DVSS) U1_13.38(OVSS0) U1_13.49(EP) U1_14.5(VSSA_PLL) U1_14.8(VSS_PLL) U1_14.12(DVSS) U1_14.23(OVSS1) U1_14.27(DVSS) U1_14.38(OVSS0) U1_14.49(EP) U1_15.5(VSSA_PLL) U1_15.8(VSS_PLL) U1_15.12(DVSS) U1_15.23(OVSS1) U1_15.27(DVSS) U1_15.38(OVSS0) U1_15.49(EP) U1_16.5(VSSA_PLL) U1_16.8(VSS_PLL) U1_16.12(DVSS) U1_16.23(OVSS1) U1_16.27(DVSS) U1_16.38(OVSS0) U1_16.49(EP) U1P_1.4(GND) U1P_1.9(EP) U1P_2.4(GND) U1P_2.9(EP) U1P_3.4(GND) U1P_3.9(EP) U2.2(GND) U2.3(GND) U2.4(N.C.) U2.5(N.C.) U2.6(GND) U2.7(GND) U3.2(GND) U4.2(GND) U5.2(GND) U6.6(GND) U6.7(GND) U7.6(GND) U7.7(GND)
0.8V: C1_1.1 C1_2.1 C1_3.1 C1_4.1 C1_5.1 C1_6.1 C1_7.1 C1_8.1 C1_9.1 C1_10.1 C1_11.1 C1_12.1 C1_13.1 C1_14.1 C1_15.1 C1_16.1 C2_1.1 C2_2.1 C2_3.1 C2_4.1 C2_5.1 C2_6.1 C2_7.1 C2_8.1 C2_9.1 C2_10.1 C2_11.1 C2_12.1 C2_13.1 C2_14.1 C2_15.1 C2_16.1 C3_1.1 C3_2.1 C3_3.1 C3_4.1 C3_5.1 C3_6.1 C3_7.1 C3_8.1 C3_9.1 C3_10.1 C3_11.1 C3_12.1 C3_13.1 C3_14.1 C3_15.1 C3_16.1 C4_1.1 C4_2.1 C4_3.1 C4_4.1 C4_5.1 C4_6.1 C4_7.1 C4_8.1 C4_9.1 C4_10.1 C4_11.1 C4_12.1 C4_13.1 C4_14.1 C4_15.1 C4_16.1 C6_1.1 C6_2.1 C6_3.1 C6_4.1 C6_5.1 C6_6.1 C6_7.1 C6_8.1 C6_9.1 C6_10.1 C6_11.1 C6_12.1 C6_13.1 C6_14.1 C6_15.1 C6_16.1 C6P_1.1 C6P_2.1 C6P_3.1 C7_1.1 C7_2.1 C7_3.1 C7_4.1 C7_5.1 C7_6.1 C7_7.1 C7_8.1 C7_9.1 C7_10.1 C7_11.1 C7_12.1 C7_13.1 C7_14.1 C7_15.1 C7_16.1 C7P_1.1 C7P_2.1 C7P_3.1 C8P_1.1 C8P_2.1 C8P_3.1 C9_1.1 C9_2.1 C9_3.1 C9_4.1 C9_5.1 C9_6.1 C9_7.1 C9_8.1 C9_9.1 C9_10.1 C9_11.1 C9_12.1 C9_13.1 C9_14.1 C9_15.1 C9_16.1 C11_1.1 C11_2.1 C11_3.1 C11_4.1 C11_5.1 C11_6.1 C11_7.1 C11_8.1 C11_9.1 C11_10.1 C11_11.1 C11_12.1 C11_13.1 C11_14.1 C11_15.1 C11_16.1 C_220_1.1 C_220_2.1 C_220_3.1 C_220_4.1 C_220_5.1 C_220_6.1 C_220_7.1 C_220_8.1 C_220_9.1 C_220_10.1 C_220_11.1 C_220_12.1 C_220_13.1 C_220_14.1 C_220_15.1 C_220_16.1 C_220_17.1 C_220_18.1 C_220_19.1 C_220_20.1 C_220_21.1 C_220_22.1 C_220_23.1 C_220_24.1 C_220_25.1 C_220_26.1 C_220_27.1 C_220_28.1 C_220_29.1 C_220_30.1 C_220_31.1 C_220_32.1 C_220_33.1 C_220_34.1 C_220_35.1 C_220_36.1 C_220_37.1 C_220_38.1 C_220_39.1 C_220_40.1 C_220_41.1 C_220_42.1 C_220_43.1 C_220_44.1 C_220_45.1 C_220_46.1 C_220_47.1 C_220_48.1 C_220_49.1 C_220_50.1 C_220_51.1 C_220_52.1 C_220_53.1 C_220_54.1 C_220_55.1 C_220_56.1 C_220_57.1 C_220_58.1 C_220_59.1 C_220_60.1 C_220_61.1 C_220_62.1 C_220_63.1 C_220_64.1 C_220_65.1 C_220_66.1 C_220_67.1 C_220_68.1 C_220_69.1 C_220_70.1 C_220_71.1 C_220_73.1 L1P_1.2 L1P_2.2 L1P_3.2 R18.2 R20.2 R21.2 U1_1.3(DVDD) U1_1.4(DVDD) U1_1.10(DVDD) U1_1.11(DVDD) U1_1.13(DVDD) U1_1.14(DVDD) U1_1.15(DVDD) U1_1.18(DVDD) U1_1.19(DVDD) U1_1.20(DVDD) U1_1.21(DVDD) U1_1.22(DVDD) U1_1.25(DVDD) U1_1.26(DVDD) U1_1.28(DVDD) U1_1.29(DVDD) U1_1.30(DVDD) U1_1.31(DVDD) U1_1.32(DVDD) U1_1.33(DVDD) U1_1.34(DVDD) U1_1.39(DVDD) U1_1.40(DVDD) U1_1.41(DVDD) U1_1.42(DVDD) U1_1.45(DVDD) U1_1.46(DVDD) U1_1.47(DVDD) U1_1.48(DVDD) U1_2.3(DVDD) U1_2.4(DVDD) U1_2.10(DVDD) U1_2.11(DVDD) U1_2.13(DVDD) U1_2.14(DVDD) U1_2.15(DVDD) U1_2.18(DVDD) U1_2.19(DVDD) U1_2.20(DVDD) U1_2.21(DVDD) U1_2.22(DVDD) U1_2.25(DVDD) U1_2.26(DVDD) U1_2.28(DVDD) U1_2.29(DVDD) U1_2.30(DVDD) U1_2.31(DVDD) U1_2.32(DVDD) U1_2.33(DVDD) U1_2.34(DVDD) U1_2.39(DVDD) U1_2.40(DVDD) U1_2.41(DVDD) U1_2.42(DVDD) U1_2.45(DVDD) U1_2.46(DVDD) U1_2.47(DVDD) U1_2.48(DVDD) U1_3.3(DVDD) U1_3.4(DVDD) U1_3.10(DVDD) U1_3.11(DVDD) U1_3.13(DVDD) U1_3.14(DVDD) U1_3.15(DVDD) U1_3.18(DVDD) U1_3.19(DVDD) U1_3.20(DVDD) U1_3.21(DVDD) U1_3.22(DVDD) U1_3.25(DVDD) U1_3.26(DVDD) U1_3.28(DVDD) U1_3.29(DVDD) U1_3.30(DVDD) U1_3.31(DVDD) U1_3.32(DVDD) U1_3.33(DVDD) U1_3.34(DVDD) U1_3.39(DVDD) U1_3.40(DVDD) U1_3.41(DVDD) U1_3.42(DVDD) U1_3.45(DVDD) U1_3.46(DVDD) U1_3.47(DVDD) U1_3.48(DVDD) U1_4.3(DVDD) U1_4.4(DVDD) U1_4.10(DVDD) U1_4.11(DVDD) U1_4.13(DVDD) U1_4.14(DVDD) U1_4.15(DVDD) U1_4.18(DVDD) U1_4.19(DVDD) U1_4.20(DVDD) U1_4.21(DVDD) U1_4.22(DVDD) U1_4.25(DVDD) U1_4.26(DVDD) U1_4.28(DVDD) U1_4.29(DVDD) U1_4.30(DVDD) U1_4.31(DVDD) U1_4.32(DVDD) U1_4.33(DVDD) U1_4.34(DVDD) U1_4.39(DVDD) U1_4.40(DVDD) U1_4.41(DVDD) U1_4.42(DVDD) U1_4.45(DVDD) U1_4.46(DVDD) U1_4.47(DVDD) U1_4.48(DVDD) U1_5.3(DVDD) U1_5.4(DVDD) U1_5.10(DVDD) U1_5.11(DVDD) U1_5.13(DVDD) U1_5.14(DVDD) U1_5.15(DVDD) U1_5.18(DVDD) U1_5.19(DVDD) U1_5.20(DVDD) U1_5.21(DVDD) U1_5.22(DVDD) U1_5.25(DVDD) U1_5.26(DVDD) U1_5.28(DVDD) U1_5.29(DVDD) U1_5.30(DVDD) U1_5.31(DVDD) U1_5.32(DVDD) U1_5.33(DVDD) U1_5.34(DVDD) U1_5.39(DVDD) U1_5.40(DVDD) U1_5.41(DVDD) U1_5.42(DVDD) U1_5.45(DVDD) U1_5.46(DVDD) U1_5.47(DVDD) U1_5.48(DVDD) U1_6.3(DVDD) U1_6.4(DVDD) U1_6.10(DVDD) U1_6.11(DVDD) U1_6.13(DVDD) U1_6.14(DVDD) U1_6.15(DVDD) U1_6.18(DVDD) U1_6.19(DVDD) U1_6.20(DVDD) U1_6.21(DVDD) U1_6.22(DVDD) U1_6.25(DVDD) U1_6.26(DVDD) U1_6.28(DVDD) U1_6.29(DVDD) U1_6.30(DVDD) U1_6.31(DVDD) U1_6.32(DVDD) U1_6.33(DVDD) U1_6.34(DVDD) U1_6.39(DVDD) U1_6.40(DVDD) U1_6.41(DVDD) U1_6.42(DVDD) U1_6.45(DVDD) U1_6.46(DVDD) U1_6.47(DVDD) U1_6.48(DVDD) U1_7.3(DVDD) U1_7.4(DVDD) U1_7.10(DVDD) U1_7.11(DVDD) U1_7.13(DVDD) U1_7.14(DVDD) U1_7.15(DVDD) U1_7.18(DVDD) U1_7.19(DVDD) U1_7.20(DVDD) U1_7.21(DVDD) U1_7.22(DVDD) U1_7.25(DVDD) U1_7.26(DVDD) U1_7.28(DVDD) U1_7.29(DVDD) U1_7.30(DVDD) U1_7.31(DVDD) U1_7.32(DVDD) U1_7.33(DVDD) U1_7.34(DVDD) U1_7.39(DVDD) U1_7.40(DVDD) U1_7.41(DVDD) U1_7.42(DVDD) U1_7.45(DVDD) U1_7.46(DVDD) U1_7.47(DVDD) U1_7.48(DVDD) U1_8.3(DVDD) U1_8.4(DVDD) U1_8.10(DVDD) U1_8.11(DVDD) U1_8.13(DVDD) U1_8.14(DVDD) U1_8.15(DVDD) U1_8.18(DVDD) U1_8.19(DVDD) U1_8.20(DVDD) U1_8.21(DVDD) U1_8.22(DVDD) U1_8.25(DVDD) U1_8.26(DVDD) U1_8.28(DVDD) U1_8.29(DVDD) U1_8.30(DVDD) U1_8.31(DVDD) U1_8.32(DVDD) U1_8.33(DVDD) U1_8.34(DVDD) U1_8.39(DVDD) U1_8.40(DVDD) U1_8.41(DVDD) U1_8.42(DVDD) U1_8.45(DVDD) U1_8.46(DVDD) U1_8.47(DVDD) U1_8.48(DVDD) U1_9.3(DVDD) U1_9.4(DVDD) U1_9.10(DVDD) U1_9.11(DVDD) U1_9.13(DVDD) U1_9.14(DVDD) U1_9.15(DVDD) U1_9.18(DVDD) U1_9.19(DVDD) U1_9.20(DVDD) U1_9.21(DVDD) U1_9.22(DVDD) U1_9.25(DVDD) U1_9.26(DVDD) U1_9.28(DVDD) U1_9.29(DVDD) U1_9.30(DVDD) U1_9.31(DVDD) U1_9.32(DVDD) U1_9.33(DVDD) U1_9.34(DVDD) U1_9.39(DVDD) U1_9.40(DVDD) U1_9.41(DVDD) U1_9.42(DVDD) U1_9.45(DVDD) U1_9.46(DVDD) U1_9.47(DVDD) U1_9.48(DVDD) U1_10.3(DVDD) U1_10.4(DVDD) U1_10.10(DVDD) U1_10.11(DVDD) U1_10.13(DVDD) U1_10.14(DVDD) U1_10.15(DVDD) U1_10.18(DVDD) U1_10.19(DVDD) U1_10.20(DVDD) U1_10.21(DVDD) U1_10.22(DVDD) U1_10.25(DVDD) U1_10.26(DVDD) U1_10.28(DVDD) U1_10.29(DVDD) U1_10.30(DVDD) U1_10.31(DVDD) U1_10.32(DVDD) U1_10.33(DVDD) U1_10.34(DVDD) U1_10.39(DVDD) U1_10.40(DVDD) U1_10.41(DVDD) U1_10.42(DVDD) U1_10.45(DVDD) U1_10.46(DVDD) U1_10.47(DVDD) U1_10.48(DVDD) U1_11.3(DVDD) U1_11.4(DVDD) U1_11.10(DVDD) U1_11.11(DVDD) U1_11.13(DVDD) U1_11.14(DVDD) U1_11.15(DVDD) U1_11.18(DVDD) U1_11.19(DVDD) U1_11.20(DVDD) U1_11.21(DVDD) U1_11.22(DVDD) U1_11.25(DVDD) U1_11.26(DVDD) U1_11.28(DVDD) U1_11.29(DVDD) U1_11.30(DVDD) U1_11.31(DVDD) U1_11.32(DVDD) U1_11.33(DVDD) U1_11.34(DVDD) U1_11.39(DVDD) U1_11.40(DVDD) U1_11.41(DVDD) U1_11.42(DVDD) U1_11.45(DVDD) U1_11.46(DVDD) U1_11.47(DVDD) U1_11.48(DVDD) U1_12.3(DVDD) U1_12.4(DVDD) U1_12.10(DVDD) U1_12.11(DVDD) U1_12.13(DVDD) U1_12.14(DVDD) U1_12.15(DVDD) U1_12.18(DVDD) U1_12.19(DVDD) U1_12.20(DVDD) U1_12.21(DVDD) U1_12.22(DVDD) U1_12.25(DVDD) U1_12.26(DVDD) U1_12.28(DVDD) U1_12.29(DVDD) U1_12.30(DVDD) U1_12.31(DVDD) U1_12.32(DVDD) U1_12.33(DVDD) U1_12.34(DVDD) U1_12.39(DVDD) U1_12.40(DVDD) U1_12.41(DVDD) U1_12.42(DVDD) U1_12.45(DVDD) U1_12.46(DVDD) U1_12.47(DVDD) U1_12.48(DVDD) U1_13.3(DVDD) U1_13.4(DVDD) U1_13.10(DVDD) U1_13.11(DVDD) U1_13.13(DVDD) U1_13.14(DVDD) U1_13.15(DVDD) U1_13.18(DVDD) U1_13.19(DVDD) U1_13.20(DVDD) U1_13.21(DVDD) U1_13.22(DVDD) U1_13.25(DVDD) U1_13.26(DVDD) U1_13.28(DVDD) U1_13.29(DVDD) U1_13.30(DVDD) U1_13.31(DVDD) U1_13.32(DVDD) U1_13.33(DVDD) U1_13.34(DVDD) U1_13.39(DVDD) U1_13.40(DVDD) U1_13.41(DVDD) U1_13.42(DVDD) U1_13.45(DVDD) U1_13.46(DVDD) U1_13.47(DVDD) U1_13.48(DVDD) U1_14.3(DVDD) U1_14.4(DVDD) U1_14.10(DVDD) U1_14.11(DVDD) U1_14.13(DVDD) U1_14.14(DVDD) U1_14.15(DVDD) U1_14.18(DVDD) U1_14.19(DVDD) U1_14.20(DVDD) U1_14.21(DVDD) U1_14.22(DVDD) U1_14.25(DVDD) U1_14.26(DVDD) U1_14.28(DVDD) U1_14.29(DVDD) U1_14.30(DVDD) U1_14.31(DVDD) U1_14.32(DVDD) U1_14.33(DVDD) U1_14.34(DVDD) U1_14.39(DVDD) U1_14.40(DVDD) U1_14.41(DVDD) U1_14.42(DVDD) U1_14.45(DVDD) U1_14.46(DVDD) U1_14.47(DVDD) U1_14.48(DVDD) U1_15.3(DVDD) U1_15.4(DVDD) U1_15.10(DVDD) U1_15.11(DVDD) U1_15.13(DVDD) U1_15.14(DVDD) U1_15.15(DVDD) U1_15.18(DVDD) U1_15.19(DVDD) U1_15.20(DVDD) U1_15.21(DVDD) U1_15.22(DVDD) U1_15.25(DVDD) U1_15.26(DVDD) U1_15.28(DVDD) U1_15.29(DVDD) U1_15.30(DVDD) U1_15.31(DVDD) U1_15.32(DVDD) U1_15.33(DVDD) U1_15.34(DVDD) U1_15.39(DVDD) U1_15.40(DVDD) U1_15.41(DVDD) U1_15.42(DVDD) U1_15.45(DVDD) U1_15.46(DVDD) U1_15.47(DVDD) U1_15.48(DVDD) U1_16.3(DVDD) U1_16.4(DVDD) U1_16.10(DVDD) U1_16.11(DVDD) U1_16.13(DVDD) U1_16.14(DVDD) U1_16.15(DVDD) U1_16.18(DVDD) U1_16.19(DVDD) U1_16.20(DVDD) U1_16.21(DVDD) U1_16.22(DVDD) U1_16.25(DVDD) U1_16.26(DVDD) U1_16.28(DVDD) U1_16.29(DVDD) U1_16.30(DVDD) U1_16.31(DVDD) U1_16.32(DVDD) U1_16.33(DVDD) U1_16.34(DVDD) U1_16.39(DVDD) U1_16.40(DVDD) U1_16.41(DVDD) U1_16.42(DVDD) U1_16.45(DVDD) U1_16.46(DVDD) U1_16.47(DVDD) U1_16.48(DVDD)
0.9V: C26.1 R29.2 R31.2 U1_1.7(VDD_PLL) U1_2.7(VDD_PLL) U1_3.7(VDD_PLL) U1_4.7(VDD_PLL) U1_5.7(VDD_PLL) U1_6.7(VDD_PLL) U1_7.7(VDD_PLL) U1_8.7(VDD_PLL) U1_9.7(VDD_PLL) U1_10.7(VDD_PLL) U1_11.7(VDD_PLL) U1_12.7(VDD_PLL) U1_13.7(VDD_PLL) U1_14.7(VDD_PLL) U1_15.7(VDD_PLL) U1_16.7(VDD_PLL)
1.8V: C5_1.2 C5_2.2 C5_3.2 C5_4.2 C5_5.2 C5_6.2 C5_7.2 C5_8.2 C5_9.2 C5_10.2 C5_11.2 C5_12.2 C5_13.2 C5_14.2 C5_15.2 C5_16.2 C8_1.1 C8_2.1 C8_3.1 C8_4.1 C8_5.1 C8_6.1 C8_7.1 C8_8.1 C8_9.1 C8_10.1 C8_11.1 C8_12.1 C8_13.1 C8_14.1 C8_15.1 C8_16.1 C25.2 R1_1.1 R1_2.1 R1_3.1 R1_4.1 R1_5.1 R1_6.1 R1_7.1 R1_8.1 R1_9.1 R1_10.1 R1_11.1 R1_12.1 R1_13.1 R1_14.1 R1_15.1 R1_16.1 R24.2 R29.1 R32.2 U1_1.6(VDDA_PLL) U1_1.24(OVDD1) U1_1.37(OVDD0) U1_2.6(VDDA_PLL) U1_2.24(OVDD1) U1_2.37(OVDD0) U1_3.6(VDDA_PLL) U1_3.24(OVDD1) U1_3.37(OVDD0) U1_4.6(VDDA_PLL) U1_4.24(OVDD1) U1_4.37(OVDD0) U1_5.6(VDDA_PLL) U1_5.24(OVDD1) U1_5.37(OVDD0) U1_6.6(VDDA_PLL) U1_6.24(OVDD1) U1_6.37(OVDD0) U1_7.6(VDDA_PLL) U1_7.24(OVDD1) U1_7.37(OVDD0) U1_8.6(VDDA_PLL) U1_8.24(OVDD1) U1_8.37(OVDD0) U1_9.6(VDDA_PLL) U1_9.24(OVDD1) U1_9.37(OVDD0) U1_10.6(VDDA_PLL) U1_10.24(OVDD1) U1_10.37(OVDD0) U1_11.6(VDDA_PLL) U1_11.24(OVDD1) U1_11.37(OVDD0) U1_12.6(VDDA_PLL) U1_12.24(OVDD1) U1_12.37(OVDD0) U1_13.6(VDDA_PLL) U1_13.24(OVDD1) U1_13.37(OVDD0) U1_14.6(VDDA_PLL) U1_14.24(OVDD1) U1_14.37(OVDD0) U1_15.6(VDDA_PLL) U1_15.24(OVDD1) U1_15.37(OVDD0) U1_16.6(VDDA_PLL) U1_16.24(OVDD1) U1_16.37(OVDD0) U6.1(OUTPUT)
3.3V: C4.1 C8.1 C9.1 C10.1 C11.1 C16.1 C17.1 J1.2 R1.2 R2.2 R17.1 R22.2 R27.1 U1.10(VDD) U1.19(AVDD) U1.26(VDD) U1.35(VUSB3V3) U1.38(VDD) U1.57(VDD) U3.4(NC) U3.5(Vout) U7.1(OUTPUT)
5.0V: C1P_1.2 C1P_2.2 C1P_3.2 C14.1 D1P_1.1(A1) D1P_1.2(A2) D1P_2.1(A1) D1P_2.2(A2) D1P_3.1(A1) D1P_3.2(A2) D7.1(C) D8.2(A) J3.1 R26.1 U1P_1.7(VCC) U1P_2.7(VCC) U1P_3.7(VCC) U2.1(OUTPUT) U4.3(Vin) U5.3(Vin)
12V: C4P_1.1 C4P_2.1 C4P_3.1 C5P_1.1 C5P_2.1 C5P_3.1 D9.2(A) D10.1(C) J3.3 J4.2 J4.4 J4.6 Q1P_1.5(D) Q1P_1.6(D) Q1P_1.7(D) Q1P_1.8(D) Q1P_2.5(D) Q1P_2.6(D) Q1P_2.7(D) Q1P_2.8(D) Q1P_3.5(D) Q1P_3.6(D) Q1P_3.7(D) Q1P_3.8(D) R15.1 R28.2
ASIC_RESET: C10_1.1 C10_2.1 C10_3.1 C10_4.1 C10_5.1 C10_6.1 C10_7.1 C10_8.1 C10_9.1 C10_10.1 C10_11.1 C10_12.1 C10_13.1 C10_14.1 C10_15.1 C10_16.1 R1_1.2 R1_2.2 R1_3.2 R1_4.2 R1_5.2 R1_6.2 R1_7.2 R1_8.2 R1_9.2 R1_10.2 R1_11.2 R1_12.2 R1_13.2 R1_14.2 R1_15.2 R1_16.2 R3.1 R13.2 U1_1.44(RSTN) U1_2.44(RSTN) U1_3.44(RSTN) U1_4.44(RSTN) U1_5.44(RSTN) U1_6.44(RSTN) U1_7.44(RSTN) U1_8.44(RSTN) U1_9.44(RSTN) U1_10.44(RSTN) U1_11.44(RSTN) U1_12.44(RSTN) U1_13.44(RSTN) U1_14.44(RSTN) U1_15.44(RSTN) U1_16.44(RSTN)
ASIC_RESET_MCU: R3.2 U1.3(AN31/PWM4H/PMD7/RP87/RE7)
BOOT1: C3P_1.1 D1P_1.3(CC) U1P_1.8(BOOT)
BOOT2: C3P_2.1 D1P_2.3(CC) U1P_2.8(BOOT)
BOOT3: C3P_3.1 D1P_3.3(CC) U1P_3.8(BOOT)
C_CLK_OUT1: U1_1.43(CORE_CLKOUT)
C_CLK_OUT2: U1_2.43(CORE_CLKOUT)
C_CLK_OUT3: U1_3.43(CORE_CLKOUT)
C_CLK_OUT4: U1_4.43(CORE_CLKOUT)
C_CLK_OUT5: U1_5.43(CORE_CLKOUT)
C_CLK_OUT6: U1_6.43(CORE_CLKOUT)
C_CLK_OUT7: U1_7.43(CORE_CLKOUT)
C_CLK_OUT8: U1_8.43(CORE_CLKOUT)
C_CLK_OUT9: U1_9.43(CORE_CLKOUT)
C_CLK_OUT10: U1_10.43(CORE_CLKOUT)
C_CLK_OUT11: U1_11.43(CORE_CLKOUT)
C_CLK_OUT12: U1_12.43(CORE_CLKOUT)
C_CLK_OUT13: U1_13.43(CORE_CLKOUT)
C_CLK_OUT14: U1_14.43(CORE_CLKOUT)
C_CLK_OUT15: U1_15.43(CORE_CLKOUT)
C_CLK_OUT16: U1_16.43(CORE_CLKOUT)
CompFB+: C5.1 R20.1 U1.11(AN5/C1IN1+/VBUSON/VBUSST/RPI37/RB5)
CompFB-: C6.1 R21.1 U1.12(AN4/C1IN2-/USBOEN/RPI36/RB4)
CONFIG_N1: R6.1 R7.2 U1_1.2(CONFIG_NI)
CONFIG_N1_MCU: R6.2 U1.42(RTCC/DMLN/RPI72/RD8)
CONFIG_N2: U1_1.35(CONFIG_NO) U1_2.2(CONFIG_NI)
CONFIG_N3: U1_2.35(CONFIG_NO) U1_3.2(CONFIG_NI)
CONFIG_N4: U1_3.35(CONFIG_NO) U1_4.2(CONFIG_NI)
CONFIG_N5: U1_4.35(CONFIG_NO) U1_5.2(CONFIG_NI)
CONFIG_N6: U1_5.35(CONFIG_NO) U1_6.2(CONFIG_NI)
CONFIG_N7: U1_6.35(CONFIG_NO) U1_7.2(CONFIG_NI)
CONFIG_N8: U1_7.35(CONFIG_NO) U1_8.2(CONFIG_NI)
CONFIG_N9: U1_8.35(CONFIG_NO) U1_9.2(CONFIG_NI)
CONFIG_N10: U1_9.35(CONFIG_NO) U1_10.2(CONFIG_NI)
CONFIG_N11: U1_10.35(CONFIG_NO) U1_11.2(CONFIG_NI)
CONFIG_N12: U1_11.35(CONFIG_NO) U1_12.2(CONFIG_NI)
CONFIG_N13: U1_12.35(CONFIG_NO) U1_13.2(CONFIG_NI)
CONFIG_N14: U1_13.35(CONFIG_NO) U1_14.2(CONFIG_NI)
CONFIG_N15: U1_14.35(CONFIG_NO) U1_15.2(CONFIG_NI)
CONFIG_N16: U1_15.35(CONFIG_NO) U1_16.2(CONFIG_NI)
CONFIG_N17: U1_16.35(CONFIG_NO)
CONFIG_P1: R4.1 R5.2 U1_1.1(CONFIG_PI)
CONFIG_P1_MCU: R4.2 U1.43(ASDA1/DPLN/RPI73/RD9)
CONFIG_P2: U1_1.36(CONFIG_PO) U1_2.1(CONFIG_PI)
CONFIG_P3: U1_2.36(CONFIG_PO) U1_3.1(CONFIG_PI)
CONFIG_P4: U1_3.36(CONFIG_PO) U1_4.1(CONFIG_PI)
CONFIG_P5: U1_4.36(CONFIG_PO) U1_5.1(CONFIG_PI)
CONFIG_P6: U1_5.36(CONFIG_PO) U1_6.1(CONFIG_PI)
CONFIG_P7: U1_6.36(CONFIG_PO) U1_7.1(CONFIG_PI)
CONFIG_P8: U1_7.36(CONFIG_PO) U1_8.1(CONFIG_PI)
CONFIG_P9: U1_8.36(CONFIG_PO) U1_9.1(CONFIG_PI)
CONFIG_P10: U1_9.36(CONFIG_PO) U1_10.1(CONFIG_PI)
CONFIG_P11: U1_10.36(CONFIG_PO) U1_11.1(CONFIG_PI)
CONFIG_P12: U1_11.36(CONFIG_PO) U1_12.1(CONFIG_PI)
CONFIG_P13: U1_12.36(CONFIG_PO) U1_13.1(CONFIG_PI)
CONFIG_P14: U1_13.36(CONFIG_PO) U1_14.1(CONFIG_PI)
CONFIG_P15: U1_14.36(CONFIG_PO) U1_15.1(CONFIG_PI)
CONFIG_P16: U1_15.36(CONFIG_PO) U1_16.1(CONFIG_PI)
CONFIG_P17: U1_16.36(CONFIG_PO)
CSN4: U1.14(AN2/C2IN2-/VMIO/RPI34/RB2)
CSP4: U1.13(AN3/C2IN1+/VPIO/RPI35/RB3)
D+: D5.1(C1) J2.3 U1.37(D+/RG2)
D-: D5.3(C2) J2.2 U1.36(D-/RG3)
DRVLogic: C2P_1.1 C2P_2.1 C2P_3.1 R17.2 R19.2 U1.2(AN30/PWM4L/PMD6/RPI86/RE6) U1P_1.6(Vlogic) U1P_2.6(Vlogic) U1P_3.6(Vlogic)
FB: C3.1 R18.1 U1.17(PGEC1/AN6/RPI38/RB6)
GREEN: D2.2(A) U1.47(PGED2/SOSCI/C3IN3-/RPI61/RC13)
HO1: Q1P_1.4(G) U1P_1.1(HO)
HO2: Q1P_2.4(G) U1P_2.1(HO)
HO3: Q1P_3.4(G) U1P_3.1(HO)
LDO3.3V-5.0V: R27.2 R30.1 U6.5(N.C.) U6.8(INPUT)
LDO5.0V: C15.1 D7.2(A) D8.1(C) R25.1 R26.2 R30.2 U3.1(Vin) U3.3(STBY) U7.5(N.C.) U7.8(INPUT)
LM12V: D9.1(C) R28.1 U2.8(INPUT) U4.1(Vout) U5.1(Vout)
LO1: Q2P_1.4(G) Q3P_1.4(G) U1P_1.3(LO)
LO2: Q2P_2.4(G) Q3P_2.4(G) U1P_2.3(LO)
LO3: Q2P_3.4(G) Q3P_3.4(G) U1P_3.3(LO)
Main OSC In: C12.1 U1.39(OSC1/RPI60/RC12) Y1.1
Main OSC Out: C13.1 U1.40(OSC2/CLKO/RC15) Y1.2
MCLR: C7.1 J1.1 R22.1 U1.7(MCLR)
MCU5.0V: R23.2 U1.34(VBUS)
MCU_MISO0: U1.5(C1IN1-/SDI2/PMA4/RPI119/RG7)
MCU_MOSI0: U1.6(C2IN3-/SDO2/PMA3/RP120/RG8)
MCU_SCK0: U1.4(C1IN3-/SCK2/PMA5/RP118/RG6)
MEAS12: C2.1 R15.2 R16.2 U1.18(PGED1/AN7/RCV/RPI39/RB7)
ORANGE: D4.2(A) U1.45(PMCS1/RPI75/RD11)
PGC: J1.5 U1.15(PGEC3/AN1/VREF-/RPI33/RB1)
PGD: J1.4 U1.16(PGED3/AN0/VREF+/RPI32/RB0)
PWM1H: U1.61(AN25/PWM1H/PMD1/RPI81/RE1)
PWM1L: U1.60(AN24/PWM1L/PMD0/RP80/RE0)
PWM2H: R10.1 U1.63(AN27/PWM2H/PMD3/RPI83/RE3) U1P_2.5(IN)
PWM2L: R11.1 U1.62(AN26/PWM2L/PMD2/RP82/RE2) U1P_1.5(IN)
PWM3H: R12.2 U1.1(AN29/PWM3H/PMD5/RP85/RE5)
PWM3L: R9.1 U1.64(AN28/PWM3L/PMD4/RP84/RE4) U1P_3.5(IN)
RED: D1.2(A) U1.48(PGEC2/SOSCO/C3IN1-/T1CK/RPI62/RC14)
REPORT_N: Q1.3(C) R1.1 U1.51(PMBE/RP67/RD3)
REPORT_NA: Q1.1(B) R24.1 U1_1.16(REPORT_N) U1_2.16(REPORT_N) U1_3.16(REPORT_N) U1_4.16(REPORT_N) U1_5.16(REPORT_N) U1_6.16(REPORT_N) U1_7.16(REPORT_N) U1_8.16(REPORT_N) U1_9.16(REPORT_N) U1_10.16(REPORT_N) U1_11.16(REPORT_N) U1_12.16(REPORT_N) U1_13.16(REPORT_N) U1_14.16(REPORT_N) U1_15.16(REPORT_N) U1_16.16(REPORT_N)
REPORT_P: Q2.3(C) R2.1 U1.50(DPH/RP66/RD2)
REPORT_PA: Q2.1(B) R32.1 U1_1.17(REPORT_P) U1_2.17(REPORT_P) U1_3.17(REPORT_P) U1_4.17(REPORT_P) U1_5.17(REPORT_P) U1_6.17(REPORT_P) U1_7.17(REPORT_P) U1_8.17(REPORT_P) U1_9.17(REPORT_P) U1_10.17(REPORT_P) U1_11.17(REPORT_P) U1_12.17(REPORT_P) U1_13.17(REPORT_P) U1_14.17(REPORT_P) U1_15.17(REPORT_P) U1_16.17(REPORT_P)
SWN1: C3P_1.2 L1P_1.1 Q1P_1.1(S) Q1P_1.2(S) Q1P_1.3(S) Q2P_1.5(D) Q2P_1.6(D) Q2P_1.7(D) Q2P_1.8(D) Q3P_1.5(D) Q3P_1.6(D) Q3P_1.7(D) Q3P_1.8(D) U1P_1.2(SW)
SWN2: C3P_2.2 L1P_2.1 Q1P_2.1(S) Q1P_2.2(S) Q1P_2.3(S) Q2P_2.5(D) Q2P_2.6(D) Q2P_2.7(D) Q2P_2.8(D) Q3P_2.5(D) Q3P_2.6(D) Q3P_2.7(D) Q3P_2.8(D) U1P_2.2(SW)
SWN3: C3P_3.2 L1P_3.1 Q1P_3.1(S) Q1P_3.2(S) Q1P_3.3(S) Q2P_3.5(D) Q2P_3.6(D) Q2P_3.7(D) Q2P_3.8(D) Q3P_3.5(D) Q3P_3.6(D) Q3P_3.7(D) Q3P_3.8(D) U1P_3.2(SW)
TP1: U1.54(C3IN2-/RP70/RD6)
TP1_1: U1.59(VCMPST2/RP97/RF1)
TP1_2: U1.58(VCMPST1/RP96/RF0)
TP8: U1.33(USBID/RP99/RF3)
TP9: U1.30(AN15/PMA0/RPI47/RB15)
TP10: U1.29(AN14/PMA1/RPI46/RB14)
TP11: U1.28(TDI/AN13/PMA10/RPI45/RB13)
TP12: U1.27(TCK/AN12/PMA11/RPI44/RB12)
TP13: U1.24(TDO/AN11/PMA12/RPI43/RB11)
TP14: U1.23(TMS/AN10/CVREF/PMA13/RPI42/RB10)
TP15: U1.22(AN9/PMA7//RPI41/RB9)
TP16: U1.21(AN8/PMA6/RPI40/RB8)
TP17: U1.8(C2IN1-/PMA2/RPI121/RG9)
U2Rx: U1.31(SDA2/PMA9/RP100/RF4)
U2Tx: U1.32(SCL2/PMA8/RP101/RF5)
USB5.0V: D5.4(C3) D5.6(C4) J2.1 R23.1 R25.2
VCAP: C1.1 U1.56(VCAP)
XCLK1: R14.2 U1.46(INT0/DMH/RP64/RD0) U1.49(VCPCON/RP65/RD1) U1.52(PMWR/RP68/RD4) U1.53(PMRD/RP69/RD5)
XCLKIN: R8.1 R14.1 U1_1.9(XCLKIN) U1_2.9(XCLKIN) U1_3.9(XCLKIN) U1_4.9(XCLKIN) U1_5.9(XCLKIN) U1_6.9(XCLKIN) U1_7.9(XCLKIN) U1_8.9(XCLKIN) U1_9.9(XCLKIN) U1_10.9(XCLKIN) U1_11.9(XCLKIN) U1_12.9(XCLKIN) U1_13.9(XCLKIN) U1_14.9(XCLKIN) U1_15.9(XCLKIN) U1_16.9(XCLKIN)
YELLOW: D3.2(A) U1.44(ASCL1/PMCS2/RPI74/RD10)

Not connected (* = marked no-connect by the designer): J2 4; U1 55(C3IN1+/VCMPST3/RP71/RD7); U6 2(GND) 3(GND) 4(N.C.); U7 2(GND) 3(GND) 4(N.C.)

## Notes on the sheet
- (in symbol CON_USB_MINI_1) gnd

## Library data of the parts
C1 C1P_1-C1P_3 C2 C2P_1-C2P_3 C3 C3P_1-C3P_3 C4-C15 C17 C25 C26 = CAP: Capacitor
  C3 C5 C6: Manufacturer PN: *
C1_1-C1_16 C2_1-C2_16 C3_1-C3_16 C4_1-C4_16 C5_1-C5_16 C6_1-C6_16 C7_1-C7_16 C8_1-C8_16 C9_1-C9_16 C10_1-C10_16 C11_1-C11_16 = Cap Semi: Capacitor (Semiconductor SIM Model); Published: 8-Jun-2000; LatestRevisionDate: 29-May-2009; LatestRevisionNote: IPC-7351 Footprint Added.; PackageReference: C1206; Publisher: Altium Limited; PackageDescription: Chip Capacitor; Value: 470nF; Manufacturer PN: *
C4P_1-C4P_3 C5P_1-C5P_3 C6P_1-C6P_3 C7P_1-C7P_3 C8P_1-C8P_3 C16 C_220_1-C_220_71 C_220_73 = Cap Semi: CL32A227MQVNNNE 220UF 6.3V 20% X5R 1210; Published: 8-Jun-2000; LatestRevisionDate: 29-May-2009; LatestRevisionNote: IPC-7351 Footprint Added.; PackageReference: C1206; Publisher: Altium Limited; PackageDescription: Chip Capacitor
  C4P_1-C4P_3 C5P_1-C5P_3: Value: 100uF
  C6P_1-C6P_3 C7P_1-C7P_3 C8P_1-C8P_3 C16: Value: 220uF
  C_220_1-C_220_71 C_220_73: Value: (OPT)220uF
D1-D4 = LED_2: NOTE: <NOTE>
D1P_1-D1P_3 = D_DUAL_A1A2CC3: NOTE: <NOTE>
D5 = D_TVS_QUAD_C1AA2AA5C3C4C6: 4 IO lines TVS; NOTE: <NOTE>
D7-D9 = D_STKY: NOTE: <NOTE>
D10 = D_TVS_UNI: Еднопосочен трансил, 600W, UBRmin13.3V@1mA; NOTE: <NOTE>
J1 = CON5: Connector
J2 = CON_USB_MINI_1: NOTE: <NOTE>
J4 = CON_PCI-E: 4.20mm Male Dual Row Angled Header WR-MPC4
L1P_1-L1P_3 = L
Q1 Q2 = BJT_NPN_B1E2C3: NOTE: <NOTE>
Q1P_1-Q1P_3 Q2P_1-Q2P_3 Q3P_1-Q3P_3 = MOS_N_D1_S1S2S3G4D5D6D7D8: NOTE: <NOTE>
R1 R1_1-R1_16 R2-R32 = Res3: Resistor; Published: 8-Jun-2000; LatestRevisionDate: 29-May-2009; LatestRevisionNote: IPC-7351 Footprint Added.; PackageReference: J1-0603; Publisher: Altium Limited; PackageDescription: Chip Resistor
  R1-R7 R13: Value: 1k
  R1_1-R1_16: Value: (OPT)1K; Manufacturer PN: *
  R8 R14 R29 R31: Value: 47
  R9-R12 R15 R20-R23: Value: 10k
  R16: Value: 2.4k
  R17 R25 R27: Value: 0
  R18: Value: 10k; Manufacturer PN: *
  R19: Value: (OPT)10k
  R24 R32: Value: 470
  R26: Value: 2
  R28: Value: 100
  R30: Value: (OPT)0
U1_1-U1_16 = A3255Q48: Avalon2 SHA256; Manufacturer PN: *
U1P_1-U1P_3 = DRVFET_LTC4442: Mosfet 12V Dual Bootstrapped PWM Sync Buck Optimised
U2 U6 U7 = IC_LM2931AD-5.0R2G_SO-8
U3 = VOLTREG LDO
U4 U5 = IC_Vout1GND2Vin3: NOTE: <NOTE>
Y1 = CRYSTAL